# Altium project RK3328.PrjPcb (part 2 of 3)

## Sheet CPU_USB2_USB3_PHY.SchDoc
size A3; SheetNumber: 9; SheetTotal: 21
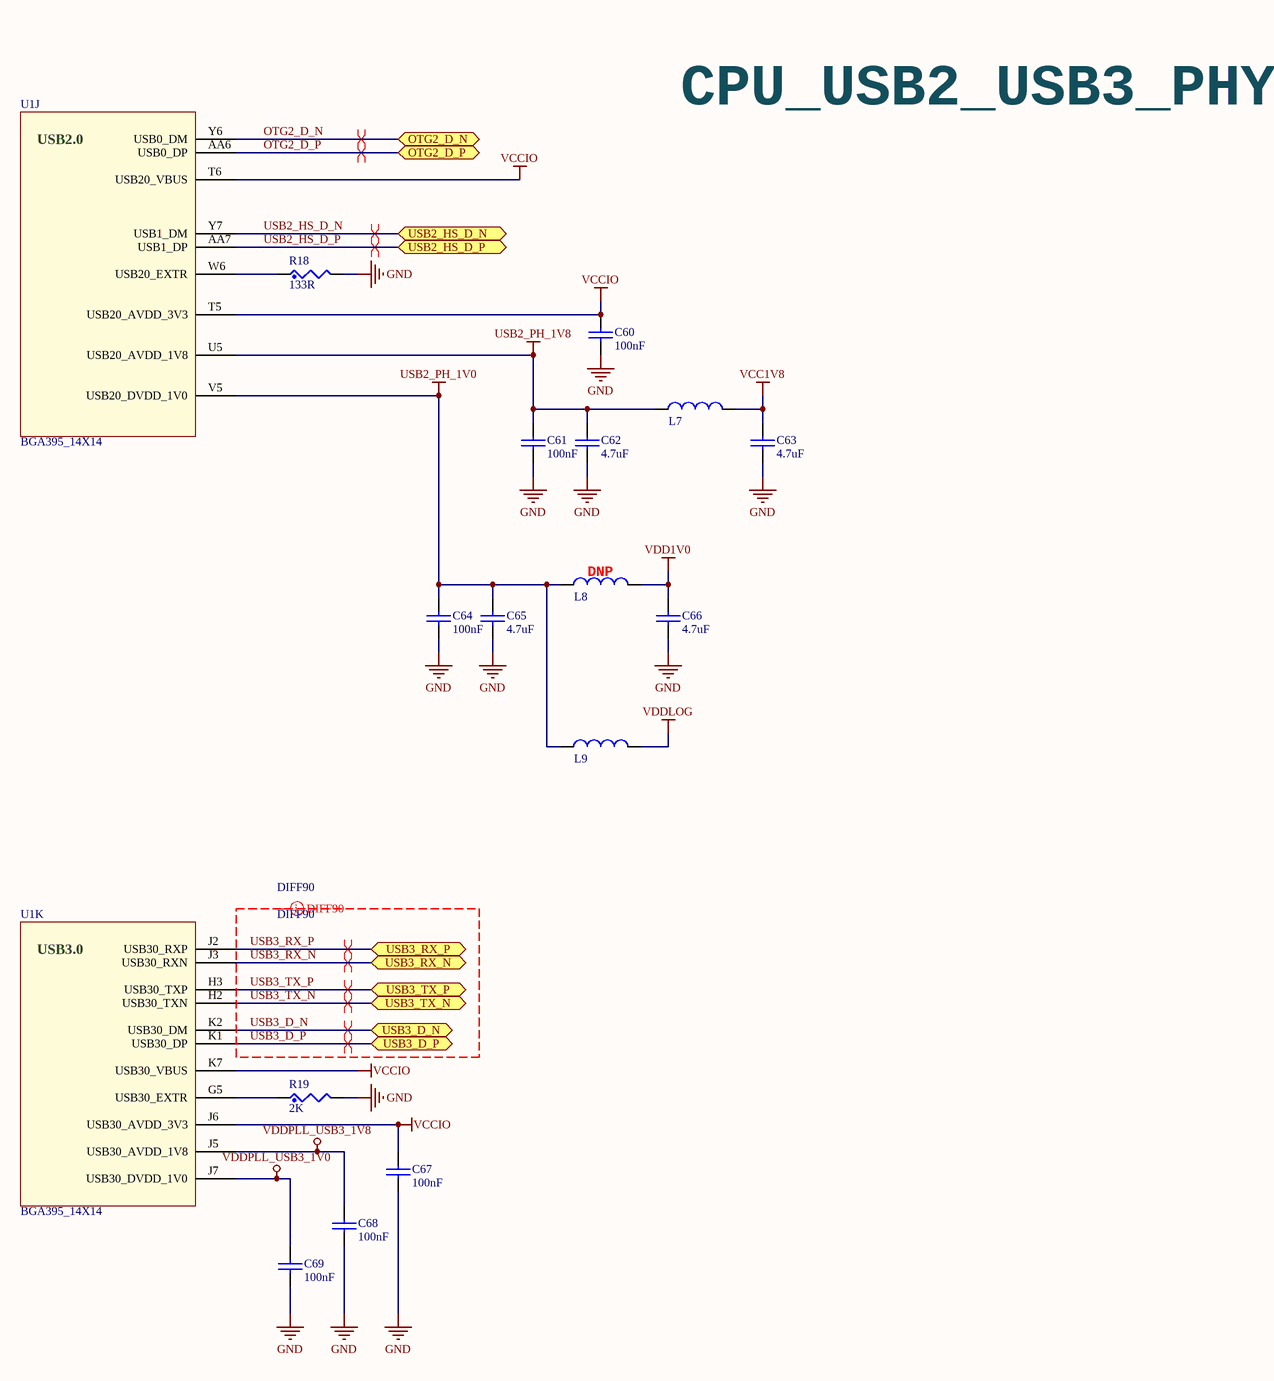
[diagram p9: CPU_USB2_USB3_PHY.SchDoc]

### Parts
C60  100nF  [0402_CC - C]
C61  100nF  [0402_CC - C]
C62  4.7uF  [0402_CC - C]
C63  4.7uF  [0402_CC - C]
C64  100nF  [0402_CC - C]
C65  4.7uF  [0402_CC - C]
C66  4.7uF  [0402_CC - C]
C67  100nF  [0402_CC - C]
C68  100nF  [0402_CC - C]
C69  100nF  [0402_CC - C]
L7  INDCHIP  [0603_C_Inductor]  (value not drawn)
L8  INDCHIP  [0603_C_Inductor]  (value not drawn)
L9  INDCHIP  [0603_C_Inductor]  (value not drawn)
R18  133R  [0402_CR]
R19  2K  [0402_CR]
U1  BGA395_14X14  [BGA395C65P21X21_1750X1750X117]  (parts J,K of 17)

### Ports
OTG2_D_N (bidir), OTG2_D_P (bidir), USB2_HS_D_N (bidir), USB2_HS_D_P (bidir), USB3_D_N (bidir), USB3_D_P (bidir), USB3_RX_N (bidir), USB3_RX_P (bidir), USB3_TX_N (bidir), USB3_TX_P (bidir)

### Nets
GND: C60.2 C61.2 C62.2 C63.2 C64.2 C65.2 C66.2 C67.2 C68.2 C69.2 R18.2 R19.2
USB2_PH_1V0: C64.1 C65.1 L8.1 L9.1 U1.V5(USB20_DVDD_1V0)
USB2_PH_1V8: C61.1 C62.1 L7.1 U1.U5(USB20_AVDD_1V8)
VCC1V8: C63.1 L7.2
VCCIO: C60.1 C67.1 U1.J6(USB30_AVDD_3V3) U1.K7(USB30_VBUS) U1.T5(USB20_AVDD_3V3) U1.T6(USB20_VBUS)
VDD1V0: C66.1 L8.2
VDDLOG: L9.2
VDDPLL_USB3_1V0: C69.1 U1.J7(USB30_DVDD_1V0)
VDDPLL_USB3_1V8: C68.1 U1.J5(USB30_AVDD_1V8)
OTG2_D_N: U1.Y6(USB0_DM) ; port OTG2_D_N
OTG2_D_P: U1.AA6(USB0_DP) ; port OTG2_D_P
USB2_HS_D_N: U1.Y7(USB1_DM) ; port USB2_HS_D_N
USB2_HS_D_P: U1.AA7(USB1_DP) ; port USB2_HS_D_P
USB3_D_N: U1.K2(USB30_DM) ; port USB3_D_N
USB3_D_P: U1.K1(USB30_DP) ; port USB3_D_P
USB3_RX_N: U1.J3(USB30_RXN) ; port USB3_RX_N
USB3_RX_P: U1.J2(USB30_RXP) ; port USB3_RX_P
USB3_TX_N: U1.H2(USB30_TXN) ; port USB3_TX_N
USB3_TX_P: U1.H3(USB30_TXP) ; port USB3_TX_P
NetR18_1: R18.1 U1.W6(USB20_EXTR)
NetR19_1: R19.1 U1.G5(USB30_EXTR)

### Layout directives
differential pair: OTG2_D_N, OTG2_D_P, USB2_HS_D_N, USB2_HS_D_P, USB3_D_N, USB3_D_P, USB3_RX_N, USB3_RX_P, USB3_TX_N, USB3_TX_P
differential pair; differential pair class DIFF90; net class DIFF90: USB3_D_N, USB3_D_P, USB3_RX_N, USB3_RX_P, USB3_TX_N, USB3_TX_P

### Notes on the sheet
- CPU_USB2_USB3_PHY
- (near L8) DNP
- (in symbol RK3328, part J) USB2.0
- (in symbol RK3328, part K) USB3.0

### Library data of the parts
C60-C69 = CAP_NP: CLASS: DISCRETE
L7-L9 = INDCHIP: Fixed Inductors  TDK, By AAR
R18 R19 = RES: CLASS: DISCRETE
U1 = RK3328: By AAR

## Sheet USB3.SchDoc
size A3; SheetNumber: 16; SheetTotal: 21
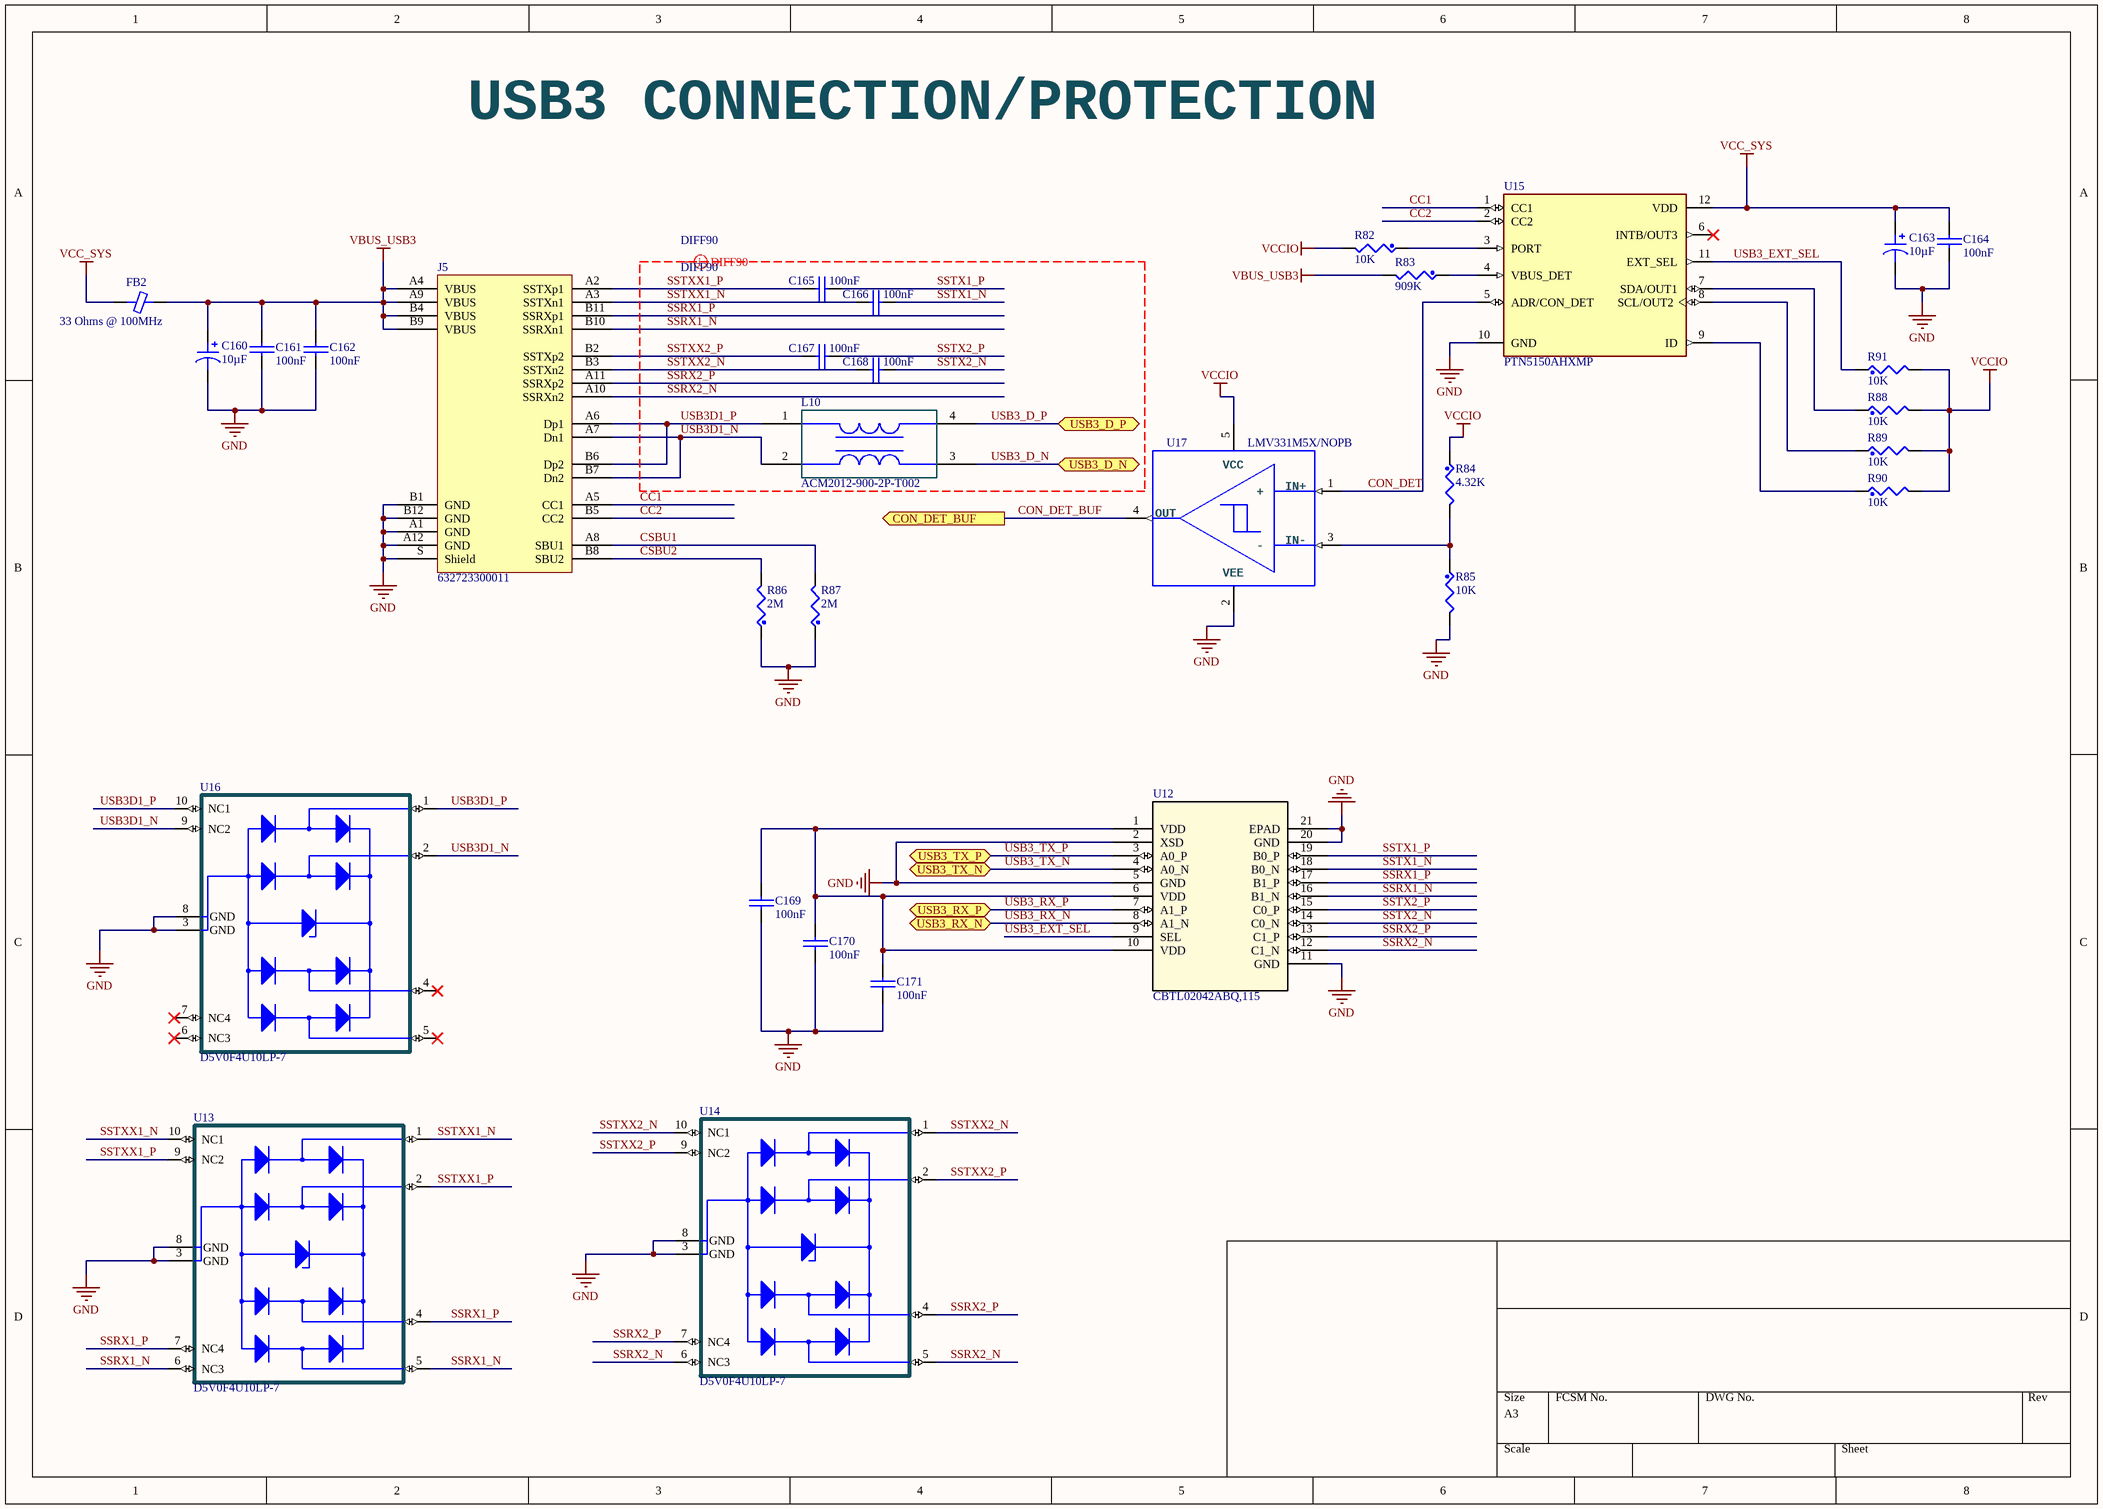
[diagram p10: USB3.SchDoc]

### Parts
C160  10µF  [CAP POL 1206_3216]
C161  100nF  [0402_CC - C]
C162  100nF  [0402_CC - C]
C163  10µF  [CAP POL 1206_3216]
C164  100nF  [0402_CC - C]
C165  100nF  [0402_CC - C]
C166  100nF  [0402_CC - C]
C167  100nF  [0402_CC - C]
C168  100nF  [0402_CC - C]
C169  100nF  [0402_CC - C]
C170  100nF  [0402_CC - C]
C171  100nF  [0402_CC - C]
FB2  33 Ohms @ 100MHz  [FER 0805_2012]
J5  632723300011  [WURTH 632723300011]
L10  ACM2012-900-2P-T002  [FP-ACM2012-MFG]
R82  10K  [0402_CR]
R83  909K  [0402_CR]
R84  4.32K  [0402_CR]
R85  10K  [0402_CR]
R86  2M  [0402_CR]
R87  2M  [0402_CR]
R88  10K  [0402_CR]
R89  10K  [0402_CR]
R90  10K  [0402_CR]
R91  10K  [0402_CR]
U12  CBTL02042ABQ,115  [DHVQFN20_SOT764-1_NXP-L]
U13  D5V0F4U10LP-7  [TI_TPD4E05U06DQAR]
U14  D5V0F4U10LP-7  [TI_TPD4E05U06DQAR]
U15  PTN5150AHXMP  [USBCONTROLLER_PTN5150AHXMP]
U16  D5V0F4U10LP-7  [TI_TPD4E05U06DQAR]
U17  LMV331M5X/NOPB  [MF05A]

### Ports
CON_DET_BUF (out), USB3_D_N (bidir), USB3_D_P (bidir), USB3_RX_N (bidir), USB3_RX_P (bidir), USB3_TX_N (bidir), USB3_TX_P (bidir)

### Nets
GND: C160.2 C161.2 C162.2 C163.2 C164.2 C169.2 C170.2 C171.2 J5.A1(GND) J5.A12(GND) J5.B1(GND) J5.B12(GND) J5.S(Shield) R85.2 R86.1 R87.1 U12.2(XSD) U12.5(GND) U12.11(GND) U12.20(GND) U12.21(EPAD) U13.3(GND) U13.8(GND) U14.3(GND) U14.8(GND) U15.10(GND) U16.3(GND) U16.8(GND) U17.2(V-)
VBUS_USB3: C160.1 C161.1 C162.1 FB2.2 J5.A4(VBUS) J5.A9(VBUS) J5.B4(VBUS) J5.B9(VBUS) R83.2
VCC_SYS: C163.1 C164.1 FB2.1 U15.12(VDD)
VCCIO: R82.2 R84.1 R88.2 R89.2 R90.2 R91.2 U17.5(V+)
CC1: J5.A5(CC1) U15.1(CC1)
CC2: J5.B5(CC2) U15.2(CC2)
CON_DET: U15.5(ADR/CON_DET) U17.1(IN+)
CON_DET_BUF: U17.4(OUT) ; port CON_DET_BUF
CSBU1: J5.A8(SBU1) R87.2
CSBU2: J5.B8(SBU2) R86.2
SSRX1_N: J5.B10(SSRXn1) U12.16(B1_N) U13.5(D2-) U13.6(NC3)
SSRX1_P: J5.B11(SSRXp1) U12.17(B1_P) U13.4(D2+) U13.7(NC4)
SSRX2_N: J5.A10(SSRXn2) U12.12(C1_N) U14.5(D2-) U14.6(NC3)
SSRX2_P: J5.A11(SSRXp2) U12.13(C1_P) U14.4(D2+) U14.7(NC4)
SSTX1_N: C166.2 U12.18(B0_N)
SSTX1_P: C165.2 U12.19(B0_P)
SSTX2_N: C168.2 U12.14(C0_N)
SSTX2_P: C167.2 U12.15(C0_P)
SSTXX1_N: C166.1 J5.A3(SSTXn1) U13.1(D1+) U13.10(NC1)
SSTXX1_P: C165.1 J5.A2(SSTXp1) U13.2(D1-) U13.9(NC2)
SSTXX2_N: C168.1 J5.B3(SSTXn2) U14.1(D1+) U14.10(NC1)
SSTXX2_P: C167.1 J5.B2(SSTXp2) U14.2(D1-) U14.9(NC2)
USB3_D_N: L10.3 ; port USB3_D_N
USB3_D_P: L10.4 ; port USB3_D_P
USB3_EXT_SEL: R91.1 U12.9(SEL) U15.11(EXT_SEL)
USB3_RX_N: U12.8(A1_N) ; port USB3_RX_N
USB3_RX_P: U12.7(A1_P) ; port USB3_RX_P
USB3_TX_N: U12.4(A0_N) ; port USB3_TX_N
USB3_TX_P: U12.3(A0_P) ; port USB3_TX_P
USB3D1_N: J5.A7(Dn1) J5.B7(Dn2) L10.2 U16.2(D1-) U16.9(NC2)
USB3D1_P: J5.A6(Dp1) J5.B6(Dp2) L10.1 U16.1(D1+) U16.10(NC1)
NetC169_1: C169.1 C170.1 C171.1 U12.1(VDD) U12.6(VDD) U12.10(VDD)
NetR82_1: R82.1 U15.3(PORT)
NetR83_1: R83.1 U15.4(VBUS_DET)
NetR84_2: R84.2 R85.1 U17.3(IN-)
NetR88_1: R88.1 U15.7(SDA/OUT1)
NetR89_1: R89.1 U15.8(SCL/OUT2)
NetR90_1: R90.1 U15.9(ID)

Not connected (* = marked no-connect by the designer): U15 6(INTB/OUT3)*; U16 4(D2+)* 5(D2-)* 6(NC3)* 7(NC4)*

### Layout directives
differential pair; differential pair class DIFF90; net class DIFF90: SSRX1_N, SSRX1_P, SSRX2_N, SSRX2_P, SSTX1_N, SSTX1_P, SSTX2_N, SSTX2_P, SSTXX1_N, SSTXX1_P, SSTXX2_N, SSTXX2_P, USB3_D_N, USB3_D_P, USB3D1_N, USB3D1_P

### Notes on the sheet
- USB3 CONNECTION/PROTECTION
- (in symbol LMV331M5X/NOPB) VCC; +; -; VEE

### Library data of the parts
C160 C163 = ATCC-211A-010-106M-T: CAP TANT 10UF 20% 10V 1206; manufacturer: Abracon LLC; Manufacturer Size Code: A; ESR (Equivalent Series Resistance): 4Ohm; Type: Molded; Part Number: ATCC-211A-010-106M-T; Value: 10µF; Capacitance: 10µF; componentlink1description: Datasheet; componentlink1url: https://abracon.com/Magnetics/inductors/ATCC-211.pdf; componentlink2description: DigiKey Link; componentlink2url: http://digikey.com/product-detail/en/abracon-llc/ATCC-211A-010-106M-T/ATCC-211A-010-106M-TCT-ND/4843468; Device Package: 1206 (3216 Metric); Features: General Purpose; Height - Seated (Max): 0.071" (1.80mm); lastupdated: 9/2/2020 1:15:55 AM; Lifecycle Status: Active; Minimum Order: 1; Mounting Type: Surface Mount; Operating Temperature: -55°C ~ 125°C; Package / Case: 1206 (3216 Metric); packaging: TapeAndReel; partid: 1668; Part Status: Active; price: 0.46; series: ATCC-211; Size / Dimension: 0.126" L x 0.063" W (3.20mm x 1.60mm); Supplier 1: DigiKey; Supplier Part Number 1: ATCC-211A-010-106M-TCT-ND; Tolerance: ±20%; Voltage - Rated: 10V
C161 C162 C164-C171 = CAP_NP: CLASS: DISCRETE
FB2 = Z0805C330ASMST: FERRITE BEAD 33 OHM 0805 1LN; Manufacturer: KEMET; Current Rating (Max): 1.2A; DC Resistance (DCR) (Max): 50mOhm; Filter Type: Signal Line; Number of Lines: 1; Part Number: Z0805C330ASMST; ComponentLink1Description: Datasheet; ComponentLink1URL: https://content.kemet.com/datasheets/F3115.pdf; ComponentLink2Description: DigiKey Link; ComponentLink2URL: http://digikey.com/product-detail/en/kemet/Z0805C330ASMST/399-9619-1-ND/3674058; Device Package: 0805 (2012 Metric); Height (Max): 0.041" (1.05mm); Impedance @ Frequency: 33 Ohms @ 100MHz; LastUpdated: 3/24/2022 2:23:39 PM; Lifecycle Status: Active; Minimum Order: 1; Mounting Type: Surface Mount; Operating Temperature: -55°C ~ 125°C; Package / Case: 0805 (2012 Metric); Packaging: TapeAndReel; PartId: 1206; Part Status: Active; Price: 0.04; Series: Z-SMS; Size / Dimension: 0.079" L x 0.049" W (2.00mm x 1.25mm); Supplier 1: DigiKey; Supplier Part Number 1: 399-9619-1-ND; Value: 33 Ohms @ 100MHz
J5 = 632723300011: CONN RCP USB3.1 TYPEC 24P SMD RA; Manufacturer: Würth Elektronik; Connector Type: USB - C (Type - C); Current Rating (Amps): 5A; Gender: Receptacle; Mating Cycles: 10000; Number of Contacts: 24; Number of Ports: 1; Shielding: Unshielded; Specifications: USB 3.1 (USB 3.1 Gen 2, Superspeed+); Voltage - Rated: 20VDC; Part Number: 632723300011; ComponentLink1Description: Datasheet; ComponentLink1URL: https://katalog.we-online.de/em/datasheet/632723x00011.pdf; ComponentLink2Description: DigiKey Link; ComponentLink2URL: http://digikey.com/product-detail/en/w-rth-elektronik/632723300011/732-9618-1-ND/5806673; LastUpdated: 5/24/2020 10:36:40 PM; Lifecycle Status: Active; Minimum Order: 1; Mounting Feature: Horizontal; Mounting Type: Surface Mount, Right Angle; Through Hole; Operating Temperature: -40°C ~ 105°C; Packaging: TapeAndReel; Part Status: Active; Price: 2.95; Series: WR-COM; Supplier 1: DigiKey; Supplier Part Number 1: 732-9618-1-ND; Termination: Solder
L10 = ACM2012-900-2P-T002: CMC 400MA 2LN 90 OHM SMD; Mfr_Name: TDK; Type: DEV; Copyright: Copyright (C) 2022 Ultra Librarian. All rights reserved.; Manufacturer_Part_Number: ACM2012-900-2P-T002; Digi-Key_Part_Number_1: 445-2207-2-ND; Digi-Key_Part_Number_2: 445-2207-1-ND; Digi-Key_Part_Number_3: 445-2207-6-ND; Digi-Key_Part_Number_4: 445-2207-2-NDL; RefDes: RefDes
R82-R91 = RES: CLASS: DISCRETE
U12 = CBTL02042ABQ,115: IC MUX/DEMUX 2:1 PCI 20DHVQFN; Mfr_Name: NXP; Copyright: Copyright (C) 2022 Ultra Librarian. All rights reserved.; Manufacturer_Part_Number: CBTL02042ABQ,115; Digi-Key_Part_Number_1: 568-6676-2-ND; Digi-Key_Part_Number_2: 568-6676-1-ND; Digi-Key_Part_Number_3: 568-6676-6-ND; RefDes: RefDes; Type: DEV
U13 U14 U16 = D5V0F4U10LP-7: TVS DIODE 5.5VWM 12VC U-DFN2510; Mfr: Diodes Incorporated; Price: None; Availability: Available; Value: *; Package: UFDFN-10 Texas Instruments; Mfr_Part_No: D5V0F4U10LP-7; Creator: AAR
U15 = PTN5150AHXMP: USB Controller USB Interface 12-X2QFN (1.6x1.6); Mfr: NXP USA; Value: *; Check_prices: https://www.snapeda.com/parts/PTN5150AHXMP/NXP%20USA%20Inc./view-part/925094/?ref=eda; Mfr_Part_Number: PTN5150AHXMP; Price: None; Package: XFQFN-12 NXP Semiconductors; Availability: Good
U17 = LMV331M5X/NOPB: IC COMPARATOR TINY LV SOT23-5; Mfr_Name: Texas Instruments; Manufacturer: NationalSemiconductor; Characteristics: LMV331M5SingleGeneralPurposeLowVoltageSingleComparator; CompType: ComparatorIC; TaMin_C: -400; TaMax_C: 850; ComponentLink1DescBC: LMV331Datasheet; ComponentLink2DescA4: LMV331WebPage; ComponentLink3DescAC: MF05APackageWebPage; Copyright: Copyright (C) 2022 Ultra Librarian. All rights reserved.; Manufacturer_Part_Number: LMV331M5X/NOPB; Digi-Key_Part_Number_1: 2156-LMV331M5X/NOPB-ND; Digi-Key_Part_Number_2: 2156-LMV331M5X/NOPB-TI-ND; Digi-Key_Part_Number_3: LMV331M5X/NOPBCT-ND; Digi-Key_Part_Number_4: LMV331M5X/NOPBDKR-ND; Digi-Key_Part_Number_5: LMV331M5X/NOPBTR-ND; RefDes: RefDes; Type: DEV; SymbolVersion: 2008-07-09; PartNumber: LMV331M5; PackageDescription: 5LeadSOT-23; PackageReference: MF05A_L; RoHS: O; ComponentLink1URL: http//wwwnationalcom/ds/LM/LMV331pdf; ComponentLink2URL: http//wwwnationalcom/pf/LM/LMV331html; ComponentLink3URL: http//wwwnationalcom/packaging/folders/mf05ahtml; Version: B1608; LatestRevisionDate: 2009-03-16; LatestRevisionNote: MassUpdate; Publisher: NationalSemiconductor; Published: 2009-03-16

## Sheet USB2_host_otg.SchDoc
size A3; SheetNumber: 17; SheetTotal: 21
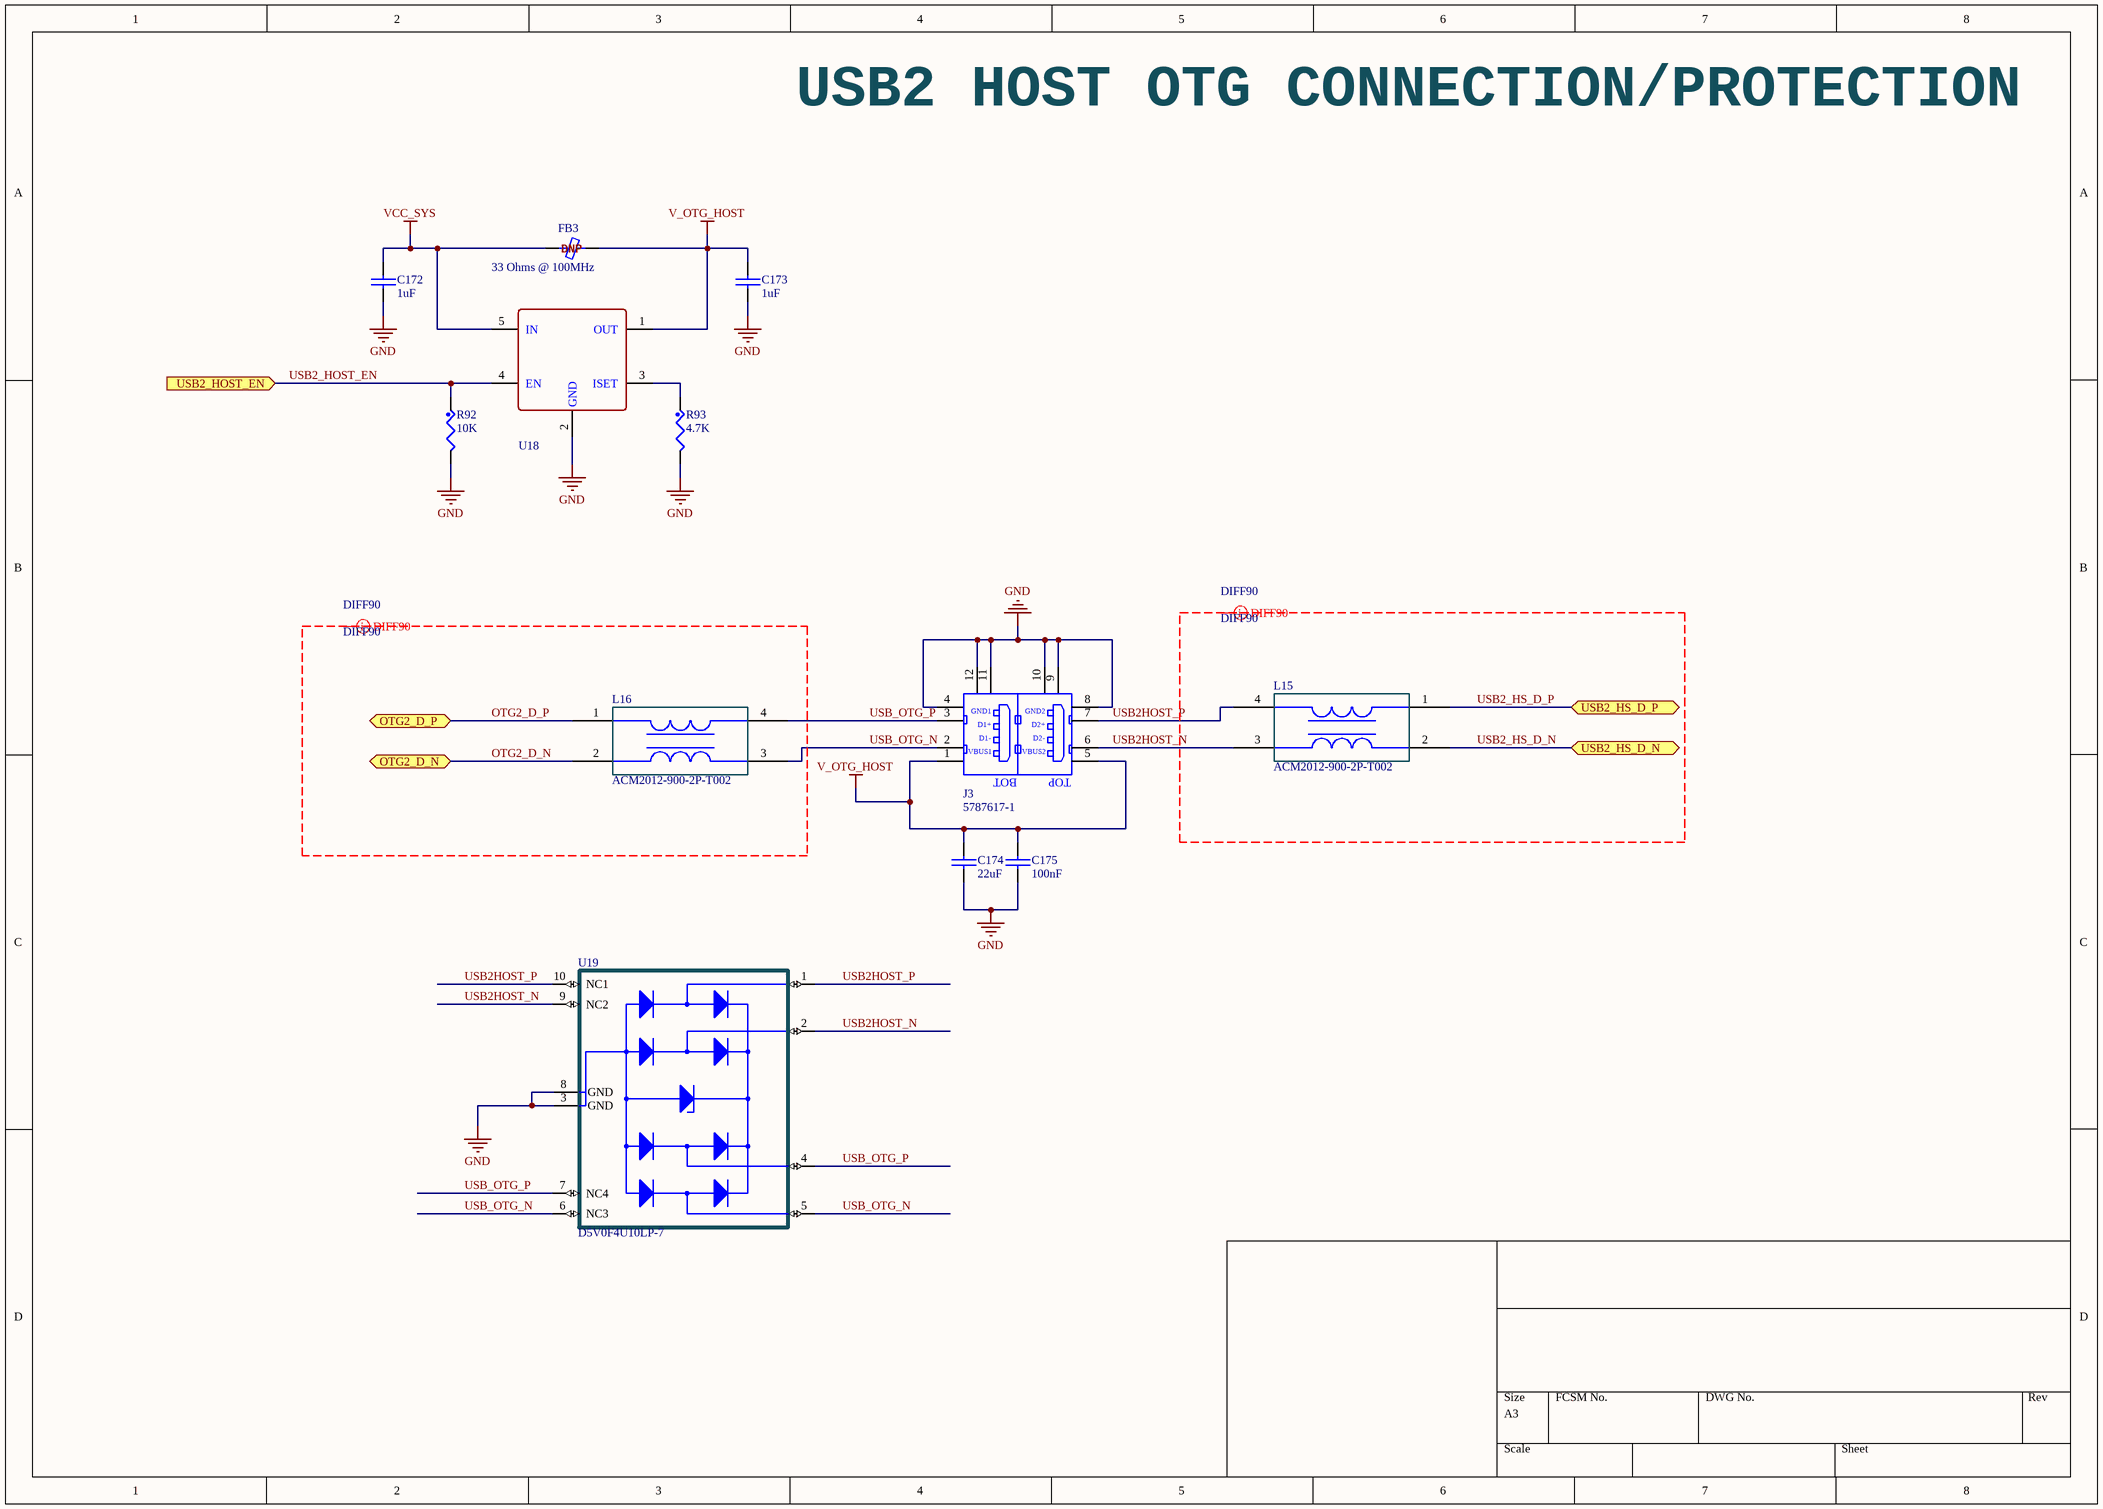
[diagram p11: USB2_host_otg.SchDoc]

### Parts
C172  1uF  [0603_CC]
C173  1uF  [0603_CC]
C174  22uF  [0603_CC]
C175  100nF  [0402_CC - C]
FB3  33 Ohms @ 100MHz  [FER 0805_2012]
J3  5787617-1  [USB-2A]
L15  ACM2012-900-2P-T002  [FP-ACM2012-MFG]
L16  ACM2012-900-2P-T002  [FP-ACM2012-MFG]
R92  10K  [0402_CR]
R93  4.7K  [0402_CR]
U18  Switch  [SOT23_5]  (value not drawn)
U19  D5V0F4U10LP-7  [TI_TPD4E05U06DQAR]

### Ports
OTG2_D_N (bidir), OTG2_D_P (bidir), USB2_HOST_EN (in), USB2_HS_D_N (bidir), USB2_HS_D_P (bidir)

### Nets
GND: C172.2 C173.2 C174.2 C175.2 J3.4(GND) J3.8(GND) J3.9(SHIELD) J3.10(SHIELD) J3.11(SHIELD) J3.12(SHIELD) R92.2 R93.2 U18.2(GND) U19.3(GND) U19.8(GND)
V_OTG_HOST: C173.1 C174.1 C175.1 FB3.2 J3.1(VBUS) J3.5(VBUS2) U18.1(OUT)
VCC_SYS: C172.1 FB3.1 U18.5(IN)
OTG2_D_N: L16.2 ; port OTG2_D_N
OTG2_D_P: L16.1 ; port OTG2_D_P
USB2_HOST_EN: R92.1 U18.4(EN) ; port USB2_HOST_EN
USB2_HS_D_N: L15.2 ; port USB2_HS_D_N
USB2_HS_D_P: L15.1 ; port USB2_HS_D_P
USB2HOST_N: J3.6(D2-) L15.3 U19.2(D1-) U19.9(NC2)
USB2HOST_P: J3.7(D2+) L15.4 U19.1(D1+) U19.10(NC1)
USB_OTG_N: J3.2(D-) L16.3 U19.5(D2-) U19.6(NC3)
USB_OTG_P: J3.3(D+) L16.4 U19.4(D2+) U19.7(NC4)
NetR93_1: R93.1 U18.3(ISET)

### Layout directives
differential pair; differential pair class DIFF90; net class DIFF90: OTG2_D_N, OTG2_D_P, USB2_HS_D_N, USB2_HS_D_P

### Notes on the sheet
- USB2 HOST OTG CONNECTION/PROTECTION
- (near FB3) DNP
- (in symbol 5787617-1_v1.1) GND1; GND2; D1+; D1-; VBUS1; BOT; TOP

### Library data of the parts
C172-C175 = CAP_NP: CLASS: DISCRETE
FB3 = Z0805C330ASMST: as FB2 on sheet USB3; Part Number: Z0805C330ASMST; ComponentLink1Description: Datasheet; ComponentLink1URL: https://content.kemet.com/datasheets/F3115.pdf; ComponentLink2Description: DigiKey Link; ComponentLink2URL: http://digikey.com/product-detail/en/kemet/Z0805C330ASMST/399-9619-1-ND/3674058; Device Package: 0805 (2012 Metric); Height (Max): 0.041" (1.05mm); Impedance @ Frequency: 33 Ohms @ 100MHz; LastUpdated: 3/24/2022 2:23:39 PM; Lifecycle Status: Active; Minimum Order: 1; Mounting Type: Surface Mount; Operating Temperature: -55°C ~ 125°C; Package / Case: 0805 (2012 Metric); Packaging: TapeAndReel; PartId: 1206; Part Status: Active; Price: 0.04; Series: Z-SMS; Size / Dimension: 0.079" L x 0.049" W (2.00mm x 1.25mm); Supplier 1: DigiKey; Supplier Part Number 1: 399-9619-1-ND; Value: 33 Ohms @ 100MHz
J3 = 5787617-1_v1.1: CONN RCPT R/A 4OVER4POS GOLD PCB; Manufacturer: TE Connectivity; Connector Type: USB - A, Stacked; Number of Contacts: 8; Gender: Receptacle; Specifications: USB 2.0; Category: Connectors, Interconnects; Family: USB, IEEE-1394 (Firewire), DVI, HDMI; Manufacturer Part Number: 5787617-1; Price 1k [$]: 1.68753; Supplier: Digikey; Supplier Part Number: A31728-ND; Value: 5787617-1; Supplier 1: Digi-Key; Supplier Part Number 1: A31728-ND; RoHS: RoHS Compliant; Stock 1: 5401; Pricing 1: 1=3.33, 10=3.197, 25=2.9308, 50=2.7978, 100=2.6645, 250=2.33144, 500=2.26484, 1000=1.93178, 2500=1.79855 (USD); Mounting Type: Through Hole, Right Angle, Horizontal; Features: Board Lock; Packaging: Tray; ComponentLink1URL: http://documents.tycoelectronics.com/commerce/DocumentDelivery/DDEController?Action=srchrtrv&DocNm=5787617&DocType=CD&DocLang=EN; ComponentLink1Description: http://documents.tycoelectronics.com/commerce/DocumentDelivery/DDEController?Action=srchrtrv&DocNm=5787617&DocType=CD&DocLang=EN
L15 L16 = ACM2012-900-2P-T002: as L10 on sheet USB3; Copyright: Copyright (C) 2022 Ultra Librarian. All rights reserved.; Manufacturer_Part_Number: ACM2012-900-2P-T002; Digi-Key_Part_Number_1: 445-2207-2-ND; Digi-Key_Part_Number_2: 445-2207-1-ND; Digi-Key_Part_Number_3: 445-2207-6-ND; Digi-Key_Part_Number_4: 445-2207-2-NDL; RefDes: RefDes
R92 R93 = RES: CLASS: DISCRETE
U18 = SY6280A: SY6280/  SY6280A  is  ultra-low  RDS(ON)  switch  with programmable current limit to protect the power source from  over  current  and  short  circuit  conditions, LIBs By AAR; Mfr_Part_No: SY6280AAC; Manufacturer: Silergy; Foot_Print: SOT-23; Supplier 1: Avnet; Supplier Part Number 1: SY6280AAAC; Package: SOT-23
U19 = D5V0F4U10LP-7: as U13 on sheet USB3; Price: None; Availability: Available; Value: *; Package: UFDFN-10 Texas Instruments; Mfr_Part_No: D5V0F4U10LP-7; Creator: AAR

## Sheet CPU_HDMI_PHY.SchDoc
size A3; SheetNumber: 10; SheetTotal: 21
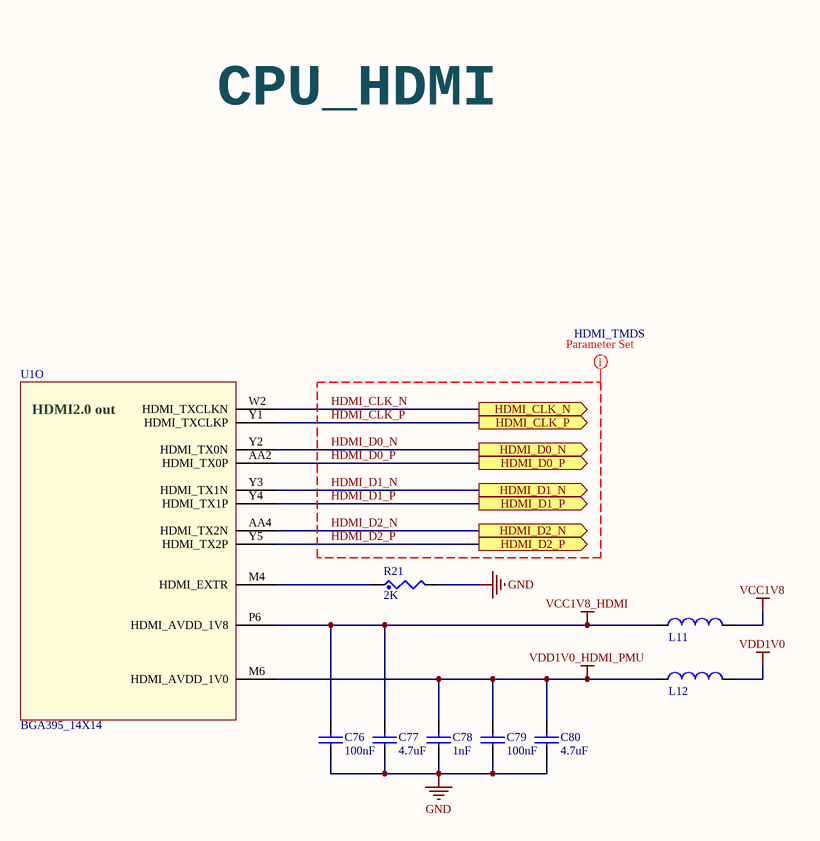
[diagram p12: CPU_HDMI_PHY.SchDoc]

### Parts
C76  100nF  [0402_CC - C]
C77  4.7uF  [0402_CC - C]
C78  1nF  [0402_CC - C]
C79  100nF  [0402_CC - C]
C80  4.7uF  [0402_CC - C]
L11  INDCHIP  [0603_C_Inductor]  (value not drawn)
L12  INDCHIP  [0603_C_Inductor]  (value not drawn)
R21  2K  [0402_CR]
U1  BGA395_14X14  [BGA395C65P21X21_1750X1750X117]  (part O of 17)

### Ports
HDMI_CLK_N (out), HDMI_CLK_P (out), HDMI_D0_N (out), HDMI_D0_P (out), HDMI_D1_N (out), HDMI_D1_P (out), HDMI_D2_N (out), HDMI_D2_P (out)

### Nets
GND: C76.2 C77.2 C78.2 C79.2 C80.2 R21.2
VCC1V8: L11.2
VCC1V8_HDMI: C76.1 C77.1 L11.1 U1.P6(HDMI_AVDD_1V8)
VDD1V0: L12.2
VDD1V0_HDMI_PMU: C78.1 C79.1 C80.1 L12.1 U1.M6(HDMI_AVDD_1V0)
HDMI_CLK_N: U1.W2(HDMI_TXCLKN) ; port HDMI_CLK_N
HDMI_CLK_P: U1.Y1(HDMI_TXCLKP) ; port HDMI_CLK_P
HDMI_D0_N: U1.Y2(HDMI_TX0N) ; port HDMI_D0_N
HDMI_D0_P: U1.AA2(HDMI_TX0P) ; port HDMI_D0_P
HDMI_D1_N: U1.Y3(HDMI_TX1N) ; port HDMI_D1_N
HDMI_D1_P: U1.Y4(HDMI_TX1P) ; port HDMI_D1_P
HDMI_D2_N: U1.AA4(HDMI_TX2N) ; port HDMI_D2_N
HDMI_D2_P: U1.Y5(HDMI_TX2P) ; port HDMI_D2_P
NetR21_1: R21.1 U1.M4(HDMI_EXTR)

### Layout directives
net class HDMI_TMDS: HDMI_CLK_N, HDMI_CLK_P, HDMI_D0_N, HDMI_D0_P, HDMI_D1_N, HDMI_D1_P, HDMI_D2_N, HDMI_D2_P

### Notes on the sheet
- CPU_HDMI
- (in symbol RK3328, part O) HDMI2.0 out

### Library data of the parts
C76-C80 = CAP_NP: CLASS: DISCRETE
L11 L12 = INDCHIP: Fixed Inductors  TDK, By AAR
R21 = RES: CLASS: DISCRETE
U1 = RK3328: By AAR

## Sheet HDMI.SchDoc
size A3; SheetNumber: 17; SheetTotal: 21
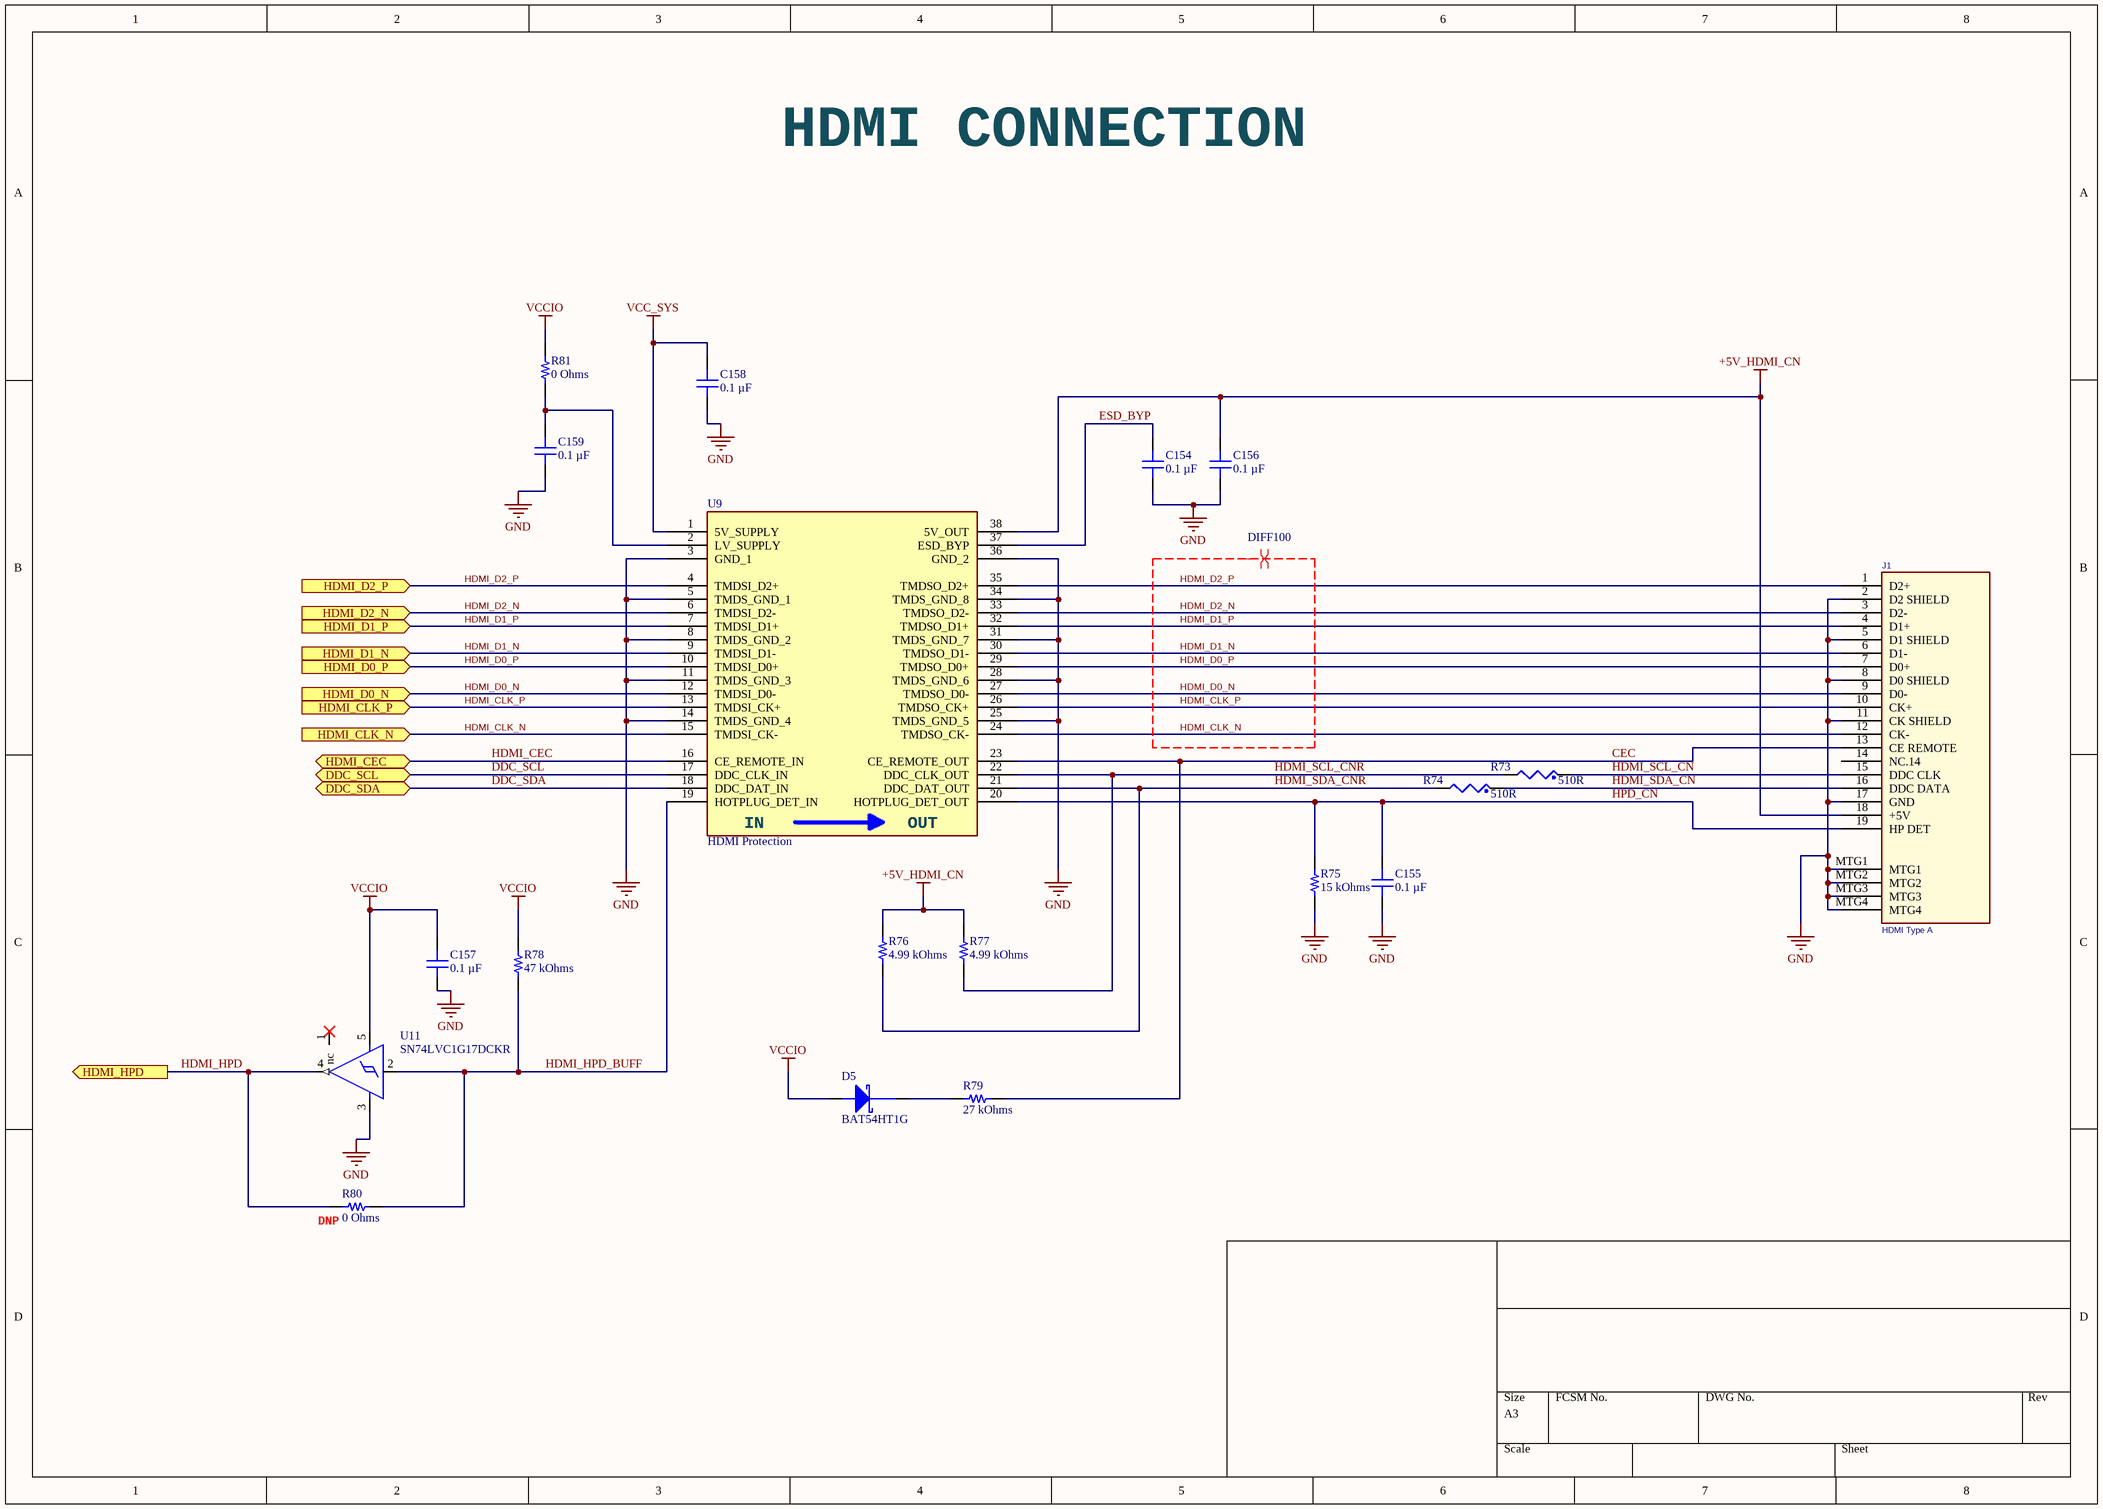
[diagram p13: HDMI.SchDoc]

### Parts
C154  0.1 µF  [CAP 0402_1005]
C155  0.1 µF  [CAP 0402_1005]
C156  0.1 µF  [CAP 0402_1005]
C157  0.1 µF  [CAP 0402_1005]
C158  0.1 µF  [CAP 0402_1005]
C159  0.1 µF  [CAP 0402_1005]
D5  BAT54HT1G  [SOD323]
J1  HDMI Type A  [HDMI Type-A]
R73  510R  [0402_CR]
R74  510R  [0402_CR]
R75  15 kOhms  [RES 0402_1005]
R76  4.99 kOhms  [RES 0402_1005]
R77  4.99 kOhms  [RES 0402_1005]
R78  47 kOhms  [RES 0402_1005]
R79  27 kOhms  [RES 0402_1005]
R80  0 Ohms  [RES 0402_1005]
R81  0 Ohms  [RES 0402_1005]
U9  HDMI Protection  [TSSOP50P640X120-38N]
U11  SN74LVC1G17DCKR  [SC70_5]

### Ports
DDC_SCL (bidir), DDC_SDA (bidir), HDMI_CEC (bidir), HDMI_CLK_N (in), HDMI_CLK_P (in), HDMI_D0_N (in), HDMI_D0_P (in), HDMI_D1_N (in), HDMI_D1_P (in), HDMI_D2_N (in), HDMI_D2_P (in), HDMI_HPD (out)

### Nets
+5V_HDMI_CN: C156.2 J1.18(+5V) R76.2 R77.2 U9.38(5V_OUT)
GND: C154.1 C155.1 C156.1 C157.1 C158.1 C159.1 J1.2(D2_SHIELD) J1.5(D1_SHIELD) J1.8(D0_SHIELD) J1.11(CK_SHIELD) J1.17(GND) J1.MTG1 J1.MTG2 J1.MTG3 J1.MTG4 R75.1 U9.3(GND_1) U9.5(TMDS_GND_1) U9.8(TMDS_GND_2) U9.11(TMDS_GND_3) U9.14(TMDS_GND_4) U9.25(TMDS_GND_5) U9.28(TMDS_GND_6) U9.31(TMDS_GND_7) U9.34(TMDS_GND_8) U9.36(GND_2) U11.3(GND)
VCC_SYS: C158.2 U9.1(5V_SUPPLY)
VCCIO: C157.2 D5.2(Anode) R78.2 R81.2 U11.5(NC1)
CEC: J1.13(CE_REMOTE) R79.2 U9.23(CE_REMOTE_OUT)
DDC_SCL: U9.17(DDC_CLK_IN) ; port DDC_SCL
DDC_SDA: U9.18(DDC_DAT_IN) ; port DDC_SDA
ESD_BYP: C154.2 U9.37(ESD_BYP)
HDMI_CEC: U9.16(CE_REMOTE_IN) ; port HDMI_CEC
HDMI_CLK_N: J1.12(CK-) U9.15(TMDSI_CK-) U9.24(TMDSO_CK-) ; port HDMI_CLK_N
HDMI_CLK_P: J1.10(CK+) U9.13(TMDSI_CK+) U9.26(TMDSO_CK+) ; port HDMI_CLK_P
HDMI_D0_N: J1.9(D0-) U9.12(TMDSI_D0-) U9.27(TMDSO_D0-) ; port HDMI_D0_N
HDMI_D0_P: J1.7(D0+) U9.10(TMDSI_D0+) U9.29(TMDSO_D0+) ; port HDMI_D0_P
HDMI_D1_N: J1.6(D1-) U9.9(TMDSI_D1-) U9.30(TMDSO_D1-) ; port HDMI_D1_N
HDMI_D1_P: J1.4(D1+) U9.7(TMDSI_D1+) U9.32(TMDSO_D1+) ; port HDMI_D1_P
HDMI_D2_N: J1.3(D2-) U9.6(TMDSI_D2-) U9.33(TMDSO_D2-) ; port HDMI_D2_N
HDMI_D2_P: J1.1(D2+) U9.4(TMDSI_D2+) U9.35(TMDSO_D2+) ; port HDMI_D2_P
HDMI_HPD: R80.1 U11.4(O) ; port HDMI_HPD
HDMI_HPD_BUFF: R78.1 R80.2 U9.19(HOTPLUG_DET_IN) U11.2(I)
HDMI_SCL_CN: J1.15(DDC_CLK) R73.1
HDMI_SCL_CNR: R73.2 R77.1 U9.22(DDC_CLK_OUT)
HDMI_SDA_CN: J1.16(DDC_DATA) R74.1
HDMI_SDA_CNR: R74.2 R76.1 U9.21(DDC_DAT_OUT)
HPD_CN: C155.2 J1.19(HP_DET) R75.2 U9.20(HOTPLUG_DET_OUT)
NetC159_2: C159.2 R81.1 U9.2(LV_SUPPLY)
NetD5_1: D5.1(Cathode) R79.1

Not connected (* = marked no-connect by the designer): J1 14(NC.14); U11 1(nc)*

### Layout directives
differential pair; differential pair class DIFF100: HDMI_CLK_N, HDMI_CLK_P, HDMI_D0_N, HDMI_D0_P, HDMI_D1_N, HDMI_D1_P, HDMI_D2_N, HDMI_D2_P

### Notes on the sheet
- HDMI CONNECTION
- (near R80) DNP
- (in symbol CM2020-00TR) IN; OUT

### Library data of the parts
C154-C159 = CC0402ZRY5V6BB104: CAP CER 0.1UF 10V Y5V 0402; manufacturer: Yageo; Temperature Coefficient: Y5V (F); Tolerance: -20%, +80%; Part Number: CC0402ZRY5V6BB104; Value: 0.1 µF; Applications: General Purpose; Capacitance: 0.1 µF; componentlink1description: Datasheet; componentlink1url: http://www.yageo.com/documents/recent/UPY-GPHC_Y5V_6.3V-to-50V_8.pdf; componentlink2description: DigiKey Link; componentlink2url: https://www.digikey.com/en/products/detail/yageo/CC0402ZRY5V6BB104/2833587; Device Package: 0402 (1005 Metric); lastupdated: 2/26/2022 9:02:21 AM; Lifecycle Status: Active; Minimum Order: 1; Mounting Type: Surface Mount, MLCC; Operating Temperature: -30°C ~ 85°C; Package / Case: 0402 (1005 Metric); packaging: CutTape; partid: 10069; Part Status: Active; price: 0.01; series: CC; Size / Dimension: 0.039" L x 0.020" W (1.00mm x 0.50mm); Supplier 1: DigiKey; Supplier Part Number 1: 311-1422-1-ND; Thickness (Max): 0.022" (0.55mm); Voltage - Rated: 10V
D5 = BAT54HT1G: DIODE SCHOTTKY 30V 0.2A SOD323; Manufacturer: Fairchild Semiconductor; Current - Average Rectified (Io): 200mA; Voltage - Forward (Vf) (Max) @ If: 800mV @ 100mA; Speed: Small Signal =< 200mA (Io), Any Speed; Reverse Recovery Time (trr): 5ns; Current - Reverse Leakage @ Vr: 2µA @ 25V; Capacitance @ Vr, F: 10pF @ 1V, 1MHz; Thermal Resistance: 600°C/W Ja; Supplier 1: Digi-Key; Manufacturer Part Number: BAT54HT1G; RoHS: RoHS Compliant; Category: Discrete Semiconductor Products; Stock 1: 11388; Pricing 1: 1=0.3, 10=0.276, 25=0.1984, 100=0.1543, 250=0.09696, 500=0.0826, 1000=0.05628 (USD); Packaging: Cut Tape (CT); Diode Type: Schottky; Voltage - DC Reverse (Vr) (Max): 30V; Mounting Type: Surface Mount; Package / Case: SC-76, SOD-323; Supplier Device Package: SOD-323; Operating Temperature - Junction: -55°C ~ 150°C; ComponentLink1URL: http://www.fairchildsemi.com/ds/BA/BAT54HT1G.pdf; ComponentLink1Description: http://www.fairchildsemi.com/ds/BA/BAT54HT1G.pdf; Supplier Part Number 1: BAT54HT1GCT-ND
J1 = HDMI Type A: CONN RCPT 19POS HDMI RT ANG SMD; Manufacturer: Molex Connector Corporation; Manufacturer Part Number: 47151-0001; .Checked PCB: MM; Number of Positions: 19; Pitch: 0.50mm (.020"); Value: 47151-0001; Gender: Receptacle; .Version: V1.1 - Changed holes to slots; .Checked SCH: MM; Category: Connectors, Interconnects; Connector Type: HDMI; Family: USB, IEEE-1394 (Firewire), DVI, HDMI; Operating Temperature: -20°C to +85°C; Price 1k [$]: 1.74610; Supplier: Digikey; Supplier Part Number: WM19086CT-ND; Supplier 1: Digi-Key; Supplier Part Number 1: WM19086CT-ND; RoHS: RoHS Compliant; Stock 1: 2756; Pricing 1: 1=3.1, 10=2.57, 50=2.1456, 100=1.9034 (USD); Number of Contacts: 19; Specifications: -; Mounting Type: Surface Mount, Right Angle, Horizontal; Features: Detent Lock; Packaging: Cut Tape (CT); Ingress Protection: -; ComponentLink1URL: http://www.molex.com/pdm_docs/sd/471510001_sd.pdf; ComponentLink1Description: http://www.molex.com/pdm_docs/sd/471510001_sd.pdf
R73 R74 = RES: CLASS: DISCRETE
R75 = RMCF0402FT15K0: RES 15K OHM 1% 1/16W 0402; Manufacturer: Stackpole Electronics Inc; Power (Watts): 0.063W, 1/16W; Temperature Coefficient: ±100ppm/°C; Part Number: RMCF0402FT15K0; Value: 15 kOhms; ComponentLink1Description: Datasheet; ComponentLink1URL: https://www.seielect.com/catalog/sei-rmcf_rmcp.pdf; ComponentLink2Description: DigiKey Link; ComponentLink2URL: https://www.digikey.com/en/products/detail/stackpole-electronics-inc/RMCF0402FT15K0/1761817; Composition: Thick Film; Device Package: 0402 (1005 Metric); Features: Automotive AEC-Q200; Height - Seated (Max): 0.016" (0.40mm); LastUpdated: 2/26/2022 8:42:09 AM; Lifecycle Status: Active; Minimum Order: 1; Number of Terminations: 2; Operating Temperature: -55°C ~ 155°C; Package / Case: 0402 (1005 Metric); Packaging: CutTape; PartId: 5006; Part Status: Active; Price: 0.01; Ratings: AEC-Q200; Resistance: 15 kOhms; Series: RMCF; Size / Dimension: 0.039" L x 0.020" W (1.00mm x 0.50mm); Supplier 1: DigiKey; Supplier Part Number 1: RMCF0402FT15K0CT-ND; Supplier Device Package: 0402; Tolerance: ±1%
R76 R77 = RN73C1E4K99BTD: RES SMD 4.99KOHM 0.1% 1/16W 0402; Manufacturer: TE Connectivity Passive Product; Power (Watts): 0.063W, 1/16W; Temperature Coefficient: ±10ppm/°C; Part Number: RN73C1E4K99BTD; Value: 4.99 kOhms; ComponentLink1Description: Datasheet; ComponentLink1URL: https://www.te.com/commerce/DocumentDelivery/DDEController?Action=srchrtrv&DocNm=1773270&DocType=DS&DocLang=English; ComponentLink2Description: DigiKey Link; ComponentLink2URL: http://digikey.com/product-detail/en/te-connectivity-passive-product/RN73C1E4K99BTD/A121705CT-ND/5248063; Composition: Thin Film; Device Package: 0402 (1005 Metric); Height - Seated (Max): 0.014" (0.35mm); LastUpdated: 2/26/2022 8:42:16 AM; Lifecycle Status: Active; Minimum Order: 1; Number of Terminations: 2; Operating Temperature: -55°C ~ 155°C; Package / Case: 0402 (1005 Metric); Packaging: TapeAndReel; PartId: 2964; Part Status: Active; Price: 0.26; Resistance: 4.99 kOhms; Series: RN73, Holsworthy; Size / Dimension: 0.039" L x 0.020" W (1.00mm x 0.50mm); Supplier 1: DigiKey; Supplier Part Number 1: A121705CT-ND; Supplier Device Package: 0402; Tolerance: ±0.1%
R78 = AC0402JR-0747KL: RES SMD 47K OHM 5% 1/16W 0402; Manufacturer: Yageo; Power (Watts): 0.063W, 1/16W; Temperature Coefficient: ±100ppm/°C; Part Number: AC0402JR-0747KL; Value: 47 kOhms; ComponentLink1Description: Datasheet; ComponentLink1URL: https://www.yageo.com/upload/media/product/productsearch/datasheet/rchip/PYu-AC_51_RoHS_L_7.pdf; ComponentLink2Description: DigiKey Link; ComponentLink2URL: https://www.digikey.com/en/products/detail/yageo/AC0402JR-0747KL/5895679; Composition: Thick Film; Device Package: 0402 (1005 Metric); Features: Automotive AEC-Q200, Moisture Resistant; Height - Seated (Max): 0.015" (0.37mm); LastUpdated: 2/26/2022 8:42:14 AM; Lifecycle Status: Active; Minimum Order: 1; Number of Terminations: 2; Operating Temperature: -55°C ~ 155°C; Package / Case: 0402 (1005 Metric); Packaging: CutTape; PartId: 3385; Part Status: Active; Price: 0.01; Ratings: AEC-Q200; Resistance: 47 kOhms; Series: AC; Size / Dimension: 0.039" L x 0.020" W (1.00mm x 0.50mm); Supplier 1: DigiKey; Supplier Part Number 1: YAG3547CT-ND; Supplier Device Package: 0402; Tolerance: ±5%
R79 = RC0402JR-0727KL: RES 27K OHM 5% 1/16W 0402; Manufacturer: Yageo; Power (Watts): 0.063W, 1/16W; Temperature Coefficient: ±100ppm/°C; Part Number: RC0402JR-0727KL; Value: 27 kOhms; ComponentLink1Description: Datasheet; ComponentLink1URL: https://www.yageo.com/upload/media/product/productsearch/datasheet/rchip/PYu-RC_Group_51_RoHS_L_10.pdf; ComponentLink2Description: DigiKey Link; ComponentLink2URL: https://www.digikey.com/en/products/detail/yageo/RC0402JR-0727KL/726451; Composition: Thick Film; Device Package: 0402 (1005 Metric); Features: Moisture Resistant; Height - Seated (Max): 0.016" (0.40mm); LastUpdated: 2/26/2022 8:42:09 AM; Lifecycle Status: Active; Minimum Order: 1; Number of Terminations: 2; Operating Temperature: -55°C ~ 155°C; Package / Case: 0402 (1005 Metric); Packaging: CutTape; PartId: 4832; Part Status: Active; Price: 0.01; Resistance: 27 kOhms; Series: RC_L; Size / Dimension: 0.039" L x 0.020" W (1.00mm x 0.50mm); Supplier 1: DigiKey; Supplier Part Number 1: 311-27KJRCT-ND; Supplier Device Package: 0402; Tolerance: ±5%
R80 R81 = CR0402AJ/-000GAS: RESA-AS 0402 0R JUMPER 63MW; Manufacturer: Bourns Inc.; Power (Watts): 0.063W, 1/16W; Part Number: CR0402AJ/-000GAS; Value: 0 Ohms; ComponentLink1Description: Datasheet; ComponentLink1URL: //media.digikey.com/pdf/Data%20Sheets/Bourns%20PDFs/CRyyyyA-AS_Model_DS.pdf; ComponentLink2Description: DigiKey Link; ComponentLink2URL: https://www.digikey.com/en/products/detail/bourns-inc/CR0402AJ-000GAS/10240110; Composition: Thick Film; Device Package: 0402 (1005 Metric); Features: Anti-Sulfur, Automotive AEC-Q200, Moisture Resistant; Height - Seated (Max): 0.015" (0.37mm); LastUpdated: 2/26/2022 8:42:02 AM; Lifecycle Status: Active; Minimum Order: 1; Number of Terminations: 2; Operating Temperature: -55°C ~ 155°C; Package / Case: 0402 (1005 Metric); Packaging: CutTape; PartId: 7106; Part Status: Active; Price: 0.01; Ratings: AEC-Q200; Resistance: 0 Ohms; Series: CR0402A-AS; Size / Dimension: 0.039" L x 0.020" W (1.00mm x 0.50mm); Supplier 1: DigiKey; Supplier Part Number 1: CR0402AJ/-000GASCT-ND; Supplier Device Package: 0402; Tolerance: Jumper
U9 = CM2020-00TR: HDMI Transmitter Port / Protection and Interface / Device 38-TSSOP; Mfr: ON Semiconductor; Value: *; Availability: Unavailable; Price: None; Mfr_Part_No: CM2020-00TR; Package: TSSOP-38 ON Semiconductor; Creator: Arman_Arvand
U11 = SN74LVC1G17DCKR: IC BUFFER SCHMIT TRIG SC705; Manufacturer: Texas Instruments; Logic Type: Schmitt Trigger - Buffer, Driver; Number of Elements: 1; Current - Output High, Low: 32mA, 32mA; Voltage - Supply: 1.65 V ~ 5.5 V; .Checked PCB: RF; Supplier 1: Digi-Key; Supplier Part Number 1: 296-11934-1-ND; Manufacturer Part Number: SN74LVC1G17DCKR; RoHS: RoHS Compliant; Category: Integrated Circuits (ICs); Stock 1: 50549; Pricing 1: 1=0.12, 10=0.097, 25=0.086, 100=0.0581, 250=0.05696, 500=0.0559, 750=0.05483 (USD); Number of Bits per Element: 1; Operating Temperature: -40°C ~ 85°C; Mounting Type: Surface Mount; Package / Case: 6-TSSOP (5 Lead), SC-88A, SOT-353; Supplier Device Package: SC-70-5; Packaging: Cut Tape (CT); ComponentLink1URL: http://www.ti.com/lit/ds/symlink/sn74lvc1g17.pdf; ComponentLink1Description: http://www.ti.com/lit/ds/symlink/sn74lvc1g17.pdf; .Checked SCH: RF

## Sheet CPU_ETH.SchDoc: CPU ETH
size A3; SheetNumber: 11; SheetTotal: 21
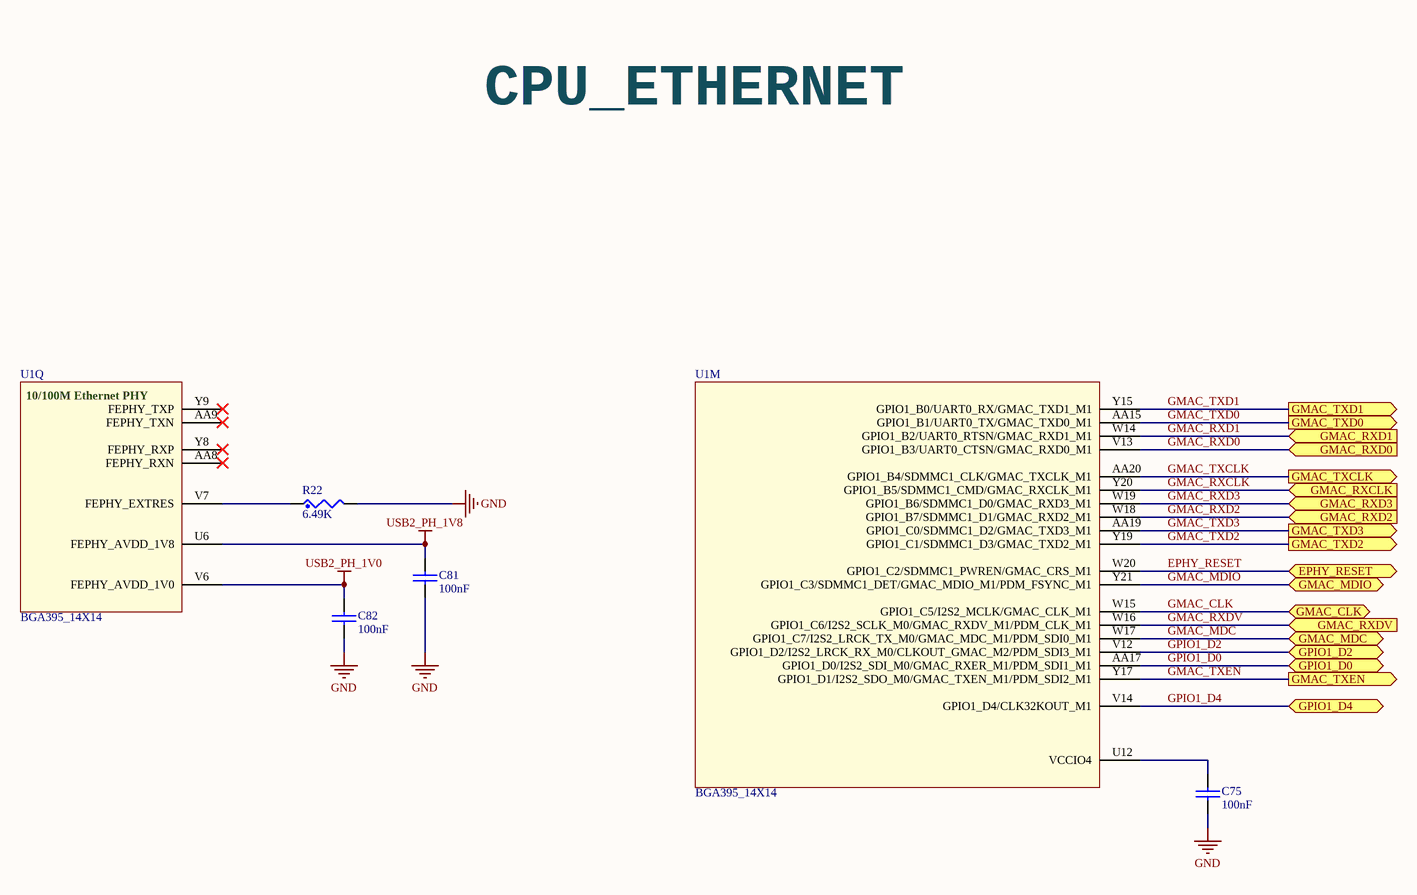
[diagram p14: CPU_ETH.SchDoc]

### Parts
C75  100nF  [0402_CC - C]
C81  100nF  [0402_CC - C]
C82  100nF  [0402_CC - C]
R22  6.49K  [0402_CR]
U1  BGA395_14X14  [BGA395C65P21X21_1750X1750X117]  (parts M,Q of 17)

### Ports
EPHY_RESET (bidir), GMAC_CLK (bidir), GMAC_MDC (bidir), GMAC_MDIO (bidir), GMAC_RXCLK (in), GMAC_RXD0 (in), GMAC_RXD1 (in), GMAC_RXD2 (in), GMAC_RXD3 (in), GMAC_RXDV (in), GMAC_TXCLK (out), GMAC_TXD0 (out), GMAC_TXD1 (out), GMAC_TXD2 (out), GMAC_TXD3 (out), GMAC_TXEN (out), GPIO1_D0 (bidir), GPIO1_D2 (bidir), GPIO1_D4 (bidir)

### Nets
GND: C75.1 C81.2 C82.2 R22.2
USB2_PH_1V0: C82.1 U1.V6(FEPHY_AVDD_1V0)
USB2_PH_1V8: C81.1 U1.U6(FEPHY_AVDD_1V8)
EPHY_RESET: U1.W20(GPIO1_C2/SDMMC1_PWREN/GMAC_CRS_M1) ; port EPHY_RESET
GMAC_CLK: U1.W15(GPIO1_C5/I2S2_MCLK/GMAC_CLK_M1) ; port GMAC_CLK
GMAC_MDC: U1.W17(GPIO1_C7/I2S2_LRCK_TX_M0/GMAC_MDC_M1/PDM_SDI0_M1) ; port GMAC_MDC
GMAC_MDIO: U1.Y21(GPIO1_C3/SDMMC1_DET/GMAC_MDIO_M1/PDM_FSYNC_M1) ; port GMAC_MDIO
GMAC_RXCLK: U1.Y20(GPIO1_B5/SDMMC1_CMD/GMAC_RXCLK_M1) ; port GMAC_RXCLK
GMAC_RXD0: U1.V13(GPIO1_B3/UART0_CTSN/GMAC_RXD0_M1) ; port GMAC_RXD0
GMAC_RXD1: U1.W14(GPIO1_B2/UART0_RTSN/GMAC_RXD1_M1) ; port GMAC_RXD1
GMAC_RXD2: U1.W18(GPIO1_B7/SDMMC1_D1/GMAC_RXD2_M1) ; port GMAC_RXD2
GMAC_RXD3: U1.W19(GPIO1_B6/SDMMC1_D0/GMAC_RXD3_M1) ; port GMAC_RXD3
GMAC_RXDV: U1.W16(GPIO1_C6/I2S2_SCLK_M0/GMAC_RXDV_M1/PDM_CLK_M1) ; port GMAC_RXDV
GMAC_TXCLK: U1.AA20(GPIO1_B4/SDMMC1_CLK/GMAC_TXCLK_M1) ; port GMAC_TXCLK
GMAC_TXD0: U1.AA15(GPIO1_B1/UART0_TX/GMAC_TXD0_M1) ; port GMAC_TXD0
GMAC_TXD1: U1.Y15(GPIO1_B0/UART0_RX/GMAC_TXD1_M1) ; port GMAC_TXD1
GMAC_TXD2: U1.Y19(GPIO1_C1/SDMMC1_D3/GMAC_TXD2_M1) ; port GMAC_TXD2
GMAC_TXD3: U1.AA19(GPIO1_C0/SDMMC1_D2/GMAC_TXD3_M1) ; port GMAC_TXD3
GMAC_TXEN: U1.Y17(GPIO1_D1/I2S2_SDO_M0/GMAC_TXEN_M1/PDM_SDI2_M1) ; port GMAC_TXEN
GPIO1_D0: U1.AA17(GPIO1_D0/I2S2_SDI_M0/GMAC_RXER_M1/PDM_SDI1_M1) ; port GPIO1_D0
GPIO1_D2: U1.V12(GPIO1_D2/I2S2_LRCK_RX_M0/CLKOUT_GMAC_M2/PDM_SDI3_M1) ; port GPIO1_D2
GPIO1_D4: U1.V14(GPIO1_D4/CLK32KOUT_M1) ; port GPIO1_D4
NetC75_2: C75.2 U1.U12(VCCIO4)
NetR22_1: R22.1 U1.V7(FEPHY_EXTRES)

Not connected (* = marked no-connect by the designer): U1 AA8(FEPHY_RXN)* AA9(FEPHY_TXN)* Y8(FEPHY_RXP)* Y9(FEPHY_TXP)*

### Notes on the sheet
- CPU_ETHERNET
- (in symbol RK3328, part Q) 10/100M Ethernet PHY

### Library data of the parts
C75 C81 C82 = CAP_NP: CLASS: DISCRETE
R22 = RES: CLASS: DISCRETE
U1 = RK3328: By AAR

## Sheet ETHERNET_PHY.SchDoc: ETHERNET PHY
size A3; Author: Arman Arvand; SheetNumber: 13; SheetTotal: 21
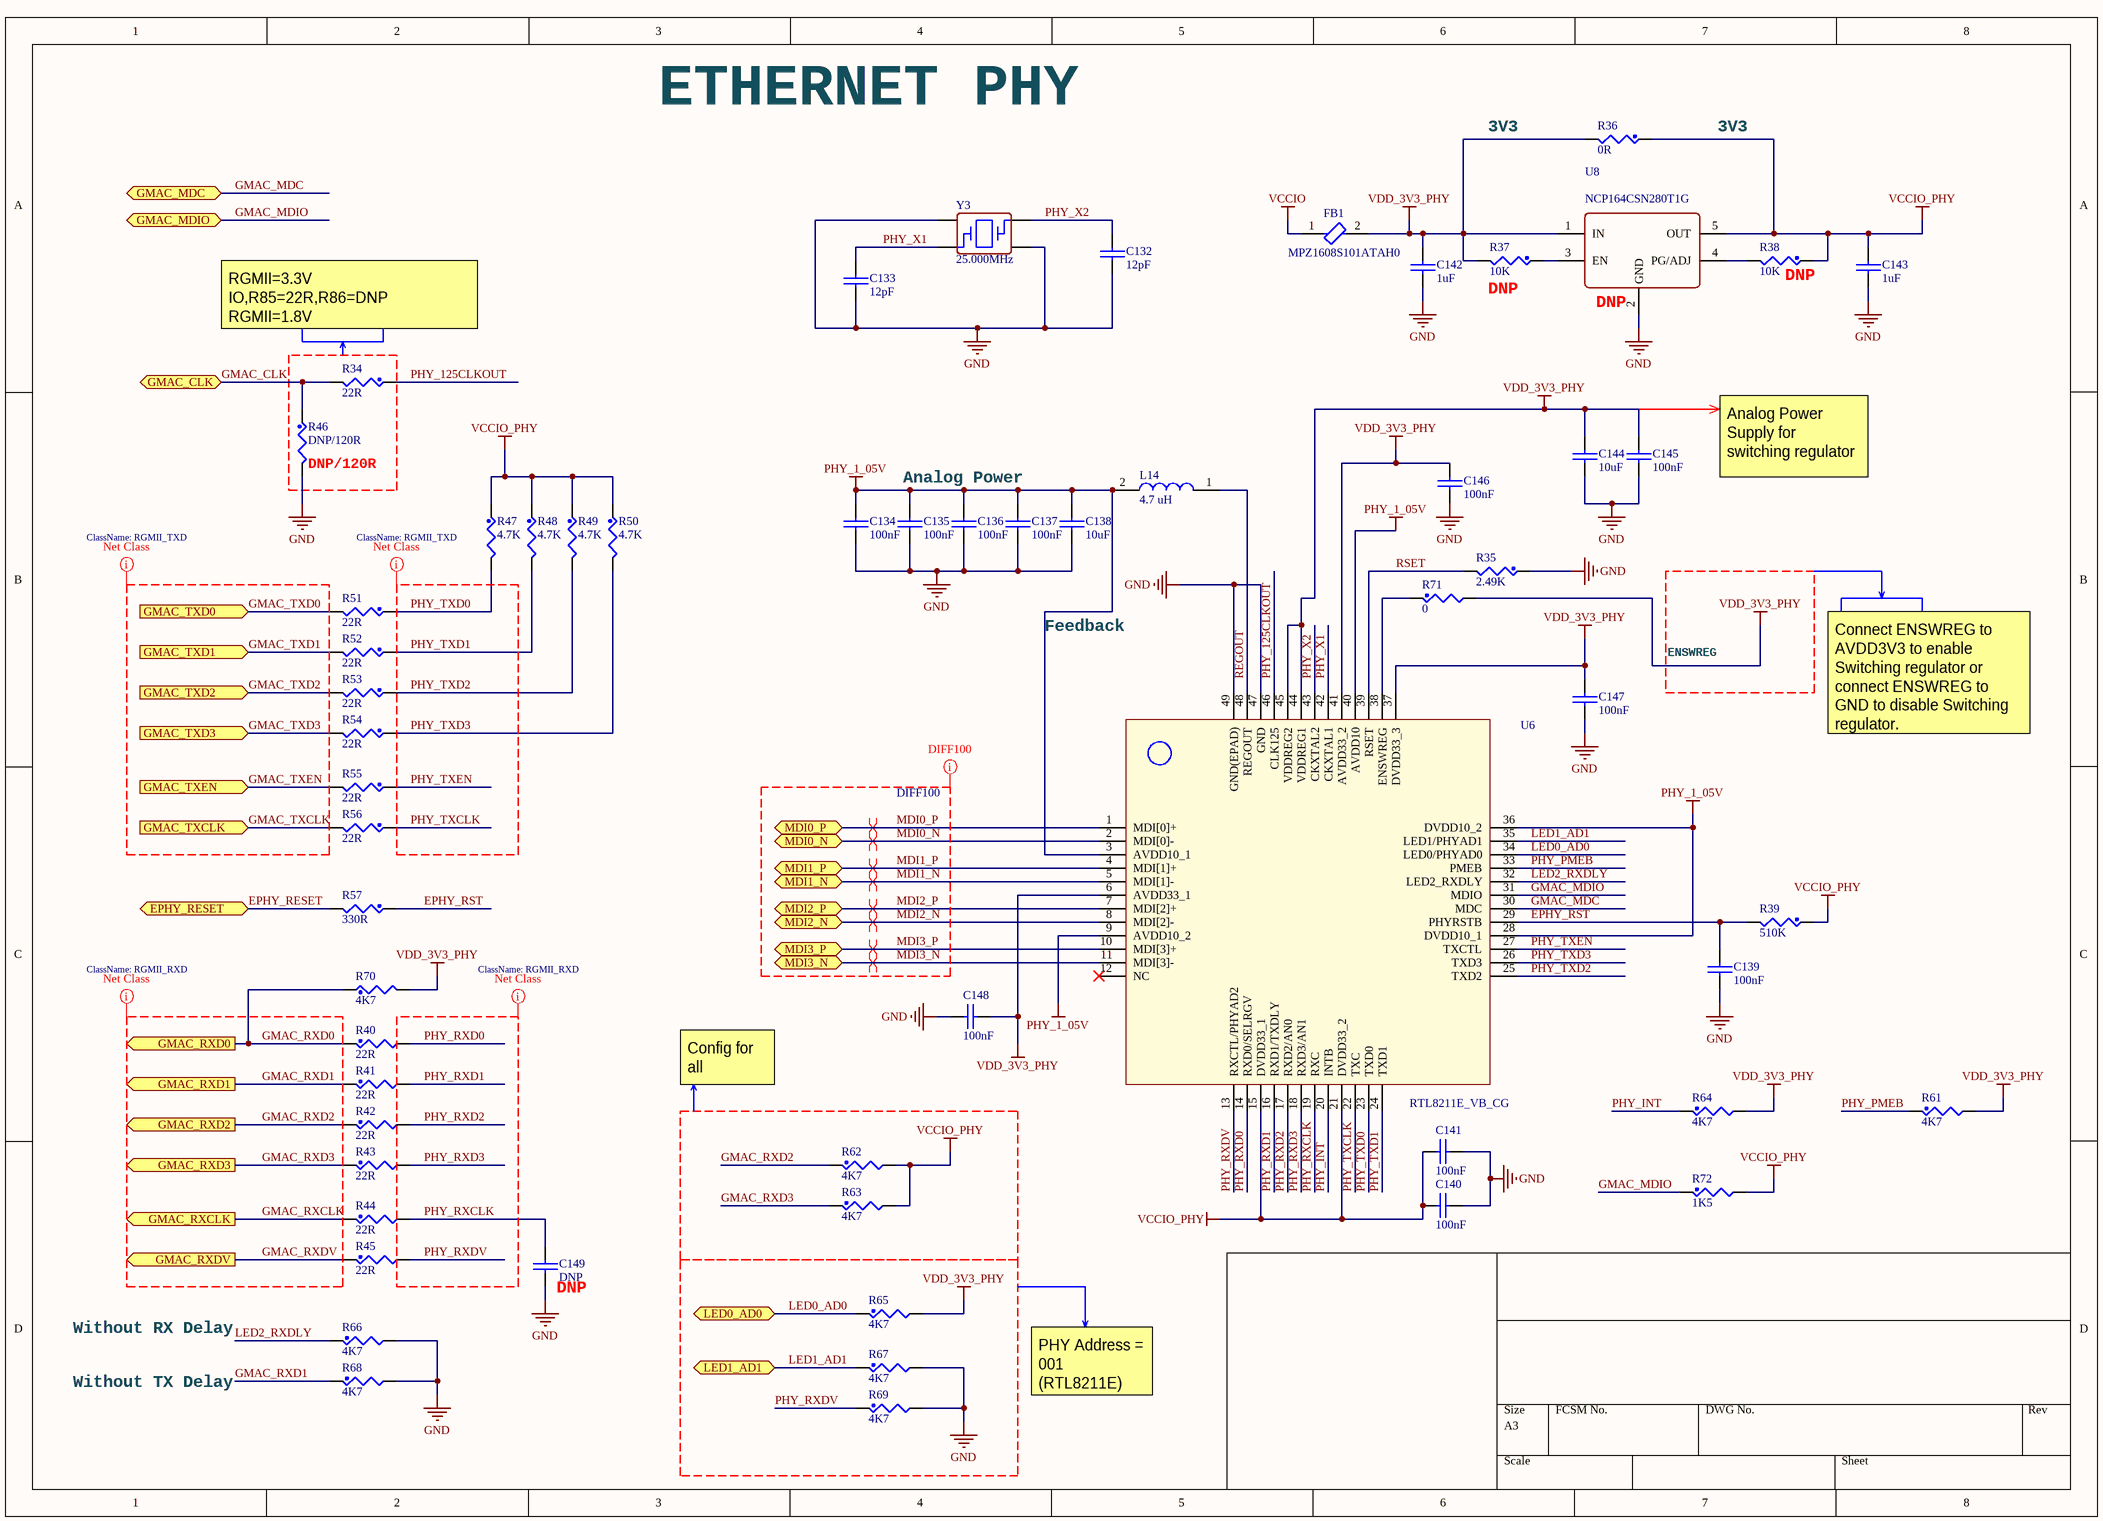
[diagram p15: ETHERNET_PHY.SchDoc]

### Parts
C132  12pF  [0402_CC - C]
C133  12pF  [0402_CC - C]
C134  100nF  [0402_CC - C]
C135  100nF  [0402_CC - C]
C136  100nF  [0402_CC - C]
C137  100nF  [0402_CC - C]
C138  10uF  [0603_CC]
C139  100nF  [0402_CC - C]
C140  100nF  [0402_CC - C]
C141  100nF  [0402_CC - C]
C142  1uF  [0402_CC - C]
C143  1uF  [0402_CC - C]
C144  10uF  [0603_CC]
C145  100nF  [0402_CC - C]
C146  100nF  [0402_CC - C]
C147  100nF  [0402_CC - C]
C148  100nF  [0402_CC - C]
C149  DNP  [0402_CC - C]
FB1  MPZ1608S101ATAH0  [FP-MPZ1608-0_6-IPC_A]
L14  4.7 uH  [1285ASH1R0MP2]
R34  22R  [0402_CR]
R35  2.49K  [0402_CR]
R36  0R  [0402_CR]
R37  10K  [0402_CR]
R38  10K  [0402_CR]
R39  510K  [0402_CR]
R40  22R  [0402_CR]
R41  22R  [0402_CR]
R42  22R  [0402_CR]
R43  22R  [0402_CR]
R44  22R  [0402_CR]
R45  22R  [0402_CR]
R46  DNP/120R  [0402_CR]
R47  4.7K  [0402_CR]
R48  4.7K  [0402_CR]
R49  4.7K  [0402_CR]
R50  4.7K  [0402_CR]
R51  22R  [0402_CR]
R52  22R  [0402_CR]
R53  22R  [0402_CR]
R54  22R  [0402_CR]
R55  22R  [0402_CR]
R56  22R  [0402_CR]
R57  330R  [0402_CR]
R61  4K7  [0402_CR]
R62  4K7  [0402_CR]
R63  4K7  [0402_CR]
R64  4K7  [0402_CR]
R65  4K7  [0402_CR]
R66  4K7  [0402_CR]
R67  4K7  [0402_CR]
R68  4K7  [0402_CR]
R69  4K7  [0402_CR]
R70  4K7  [0402_CR]
R71  0  [0402_CR]
R72  1K5  [0402_CR]
U6  RTL8211E_VB_CG  [QFN40P600X600X100-49N]
U8  NCP164CSN280T1G  [TSOP-5]
Y3  25.000MHz  [ABM8G]

### Blocks framed on the sheet
DNP/120R: R34 R46

### Ports
EPHY_RESET (bidir), GMAC_CLK (bidir), GMAC_MDC (bidir), GMAC_MDIO (bidir), GMAC_RXCLK (out), GMAC_RXD0 (out), GMAC_RXD1 (out), GMAC_RXD2 (out), GMAC_RXD3 (out), GMAC_RXDV (out), GMAC_TXCLK (in), GMAC_TXD0 (in), GMAC_TXD1 (in), GMAC_TXD2 (in), GMAC_TXD3 (in), GMAC_TXEN (in), LED0_AD0 (bidir), LED1_AD1 (bidir), MDI0_N (bidir), MDI0_P (bidir), MDI1_N (bidir), MDI1_P (bidir), MDI2_N (bidir), MDI2_P (bidir), MDI3_N (bidir), MDI3_P (bidir)

### Nets
GND: C132.2 C133.2 C134.2 C135.2 C136.2 C137.2 C138.2 C139.2 C140.2 C141.2 C142.2 C143.2 C144.2 C145.2 C146.1 C147.1 C148.1 C149.1 R35.1 R46.2 R66.2 R67.2 R68.2 R69.2 U6.47(GND) U6.49(GND(EPAD)) U8.2(GND) Y3.2 Y3.4
PHY_1_05V: C134.1 C135.1 C136.1 C137.1 C138.1 L14.2 U6.3(AVDD10_1) U6.9(AVDD10_2) U6.28(DVDD10_1) U6.36(DVDD10_2) U6.40(AVDD10)
VCCIO: FB1.1
VCCIO_PHY: C140.1 C141.1 C143.1 R36.1 R38.1 R39.1 R47.1 R48.1 R49.1 R50.1 R62.2 R63.2 R72.2 U6.15(DVDD33_1) U6.21(DVDD33_2) U8.5(OUT)
VDD_3V3_PHY: C142.1 C144.1 C145.1 C146.2 C147.2 C148.2 FB1.2 R36.2 R37.2 R61.2 R64.2 R65.2 R70.2 R71.2 U6.6(AVDD33_1) U6.37(DVDD33_3) U6.41(AVDD33_2) U6.44(VDDREG1) U6.45(VDDREG2) U8.1(IN)
EPHY_RESET: R57.2 ; port EPHY_RESET
EPHY_RST: C139.1 R39.2 R57.1 U6.29(PHYRSTB)
GMAC_CLK: R34.2 R46.1 ; port GMAC_CLK
GMAC_MDC: U6.30(MDC) ; port GMAC_MDC
GMAC_MDIO: R72.1 U6.31(MDIO) ; port GMAC_MDIO
GMAC_RXCLK: R44.1 ; port GMAC_RXCLK
GMAC_RXD0: R40.1 R70.1 ; port GMAC_RXD0
GMAC_RXD1: R41.1 R68.1 ; port GMAC_RXD1
GMAC_RXD2: R42.1 R62.1 ; port GMAC_RXD2
GMAC_RXD3: R43.1 R63.1 ; port GMAC_RXD3
GMAC_RXDV: R45.1 ; port GMAC_RXDV
GMAC_TXCLK: R56.2 ; port GMAC_TXCLK
GMAC_TXD0: R51.2 ; port GMAC_TXD0
GMAC_TXD1: R52.2 ; port GMAC_TXD1
GMAC_TXD2: R53.2 ; port GMAC_TXD2
GMAC_TXD3: R54.2 ; port GMAC_TXD3
GMAC_TXEN: R55.2 ; port GMAC_TXEN
LED0_AD0: R65.1 U6.34(LED0/PHYAD0) ; port LED0_AD0
LED1_AD1: R67.1 U6.35(LED1/PHYAD1) ; port LED1_AD1
LED2_RXDLY: R66.1 U6.32(LED2_RXDLY)
MDI0_N: U6.2(MDI[0]-) ; port MDI0_N
MDI0_P: U6.1(MDI[0]+) ; port MDI0_P
MDI1_N: U6.5(MDI[1]-) ; port MDI1_N
MDI1_P: U6.4(MDI[1]+) ; port MDI1_P
MDI2_N: U6.8(MDI[2]-) ; port MDI2_N
MDI2_P: U6.7(MDI[2]+) ; port MDI2_P
MDI3_N: U6.11(MDI[3]-) ; port MDI3_N
MDI3_P: U6.10(MDI[3]+) ; port MDI3_P
PHY_125CLKOUT: R34.1 U6.46(CLK125)
PHY_INT: R64.1 U6.20(INTB)
PHY_PMEB: R61.1 U6.33(PMEB)
PHY_RXCLK: C149.2 R44.2 U6.19(RXC)
PHY_RXD0: R40.2 U6.14(RXD0/SELRGV)
PHY_RXD1: R41.2 U6.16(RXD1/TXDLY)
PHY_RXD2: R42.2 U6.17(RXD2/AN0)
PHY_RXD3: R43.2 U6.18(RXD3/AN1)
PHY_RXDV: R45.2 R69.1 U6.13(RXCTL/PHYAD2)
PHY_TXCLK: R56.1 U6.22(TXC)
PHY_TXD0: R47.2 R51.1 U6.23(TXD0)
PHY_TXD1: R48.2 R52.1 U6.24(TXD1)
PHY_TXD2: R49.2 R53.1 U6.25(TXD2)
PHY_TXD3: R50.2 R54.1 U6.26(TXD3)
PHY_TXEN: R55.1 U6.27(TXCTL)
PHY_X1: C133.1 U6.42(CKXTAL1) Y3.1
PHY_X2: C132.1 U6.43(CKXTAL2) Y3.3
REGOUT: L14.1 U6.48(REGOUT)
RSET: R35.2 U6.39(RSET)
NetR37_1: R37.1 U8.3(EN)
NetR38_2: R38.2 U8.4(PG/ADJ)
NetR71_1: R71.1 U6.38(ENSWREG)

Not connected (* = marked no-connect by the designer): U6 12(NC)*

### Layout directives
differential pair: MDI0_N, MDI0_P, MDI1_N, MDI1_P, MDI2_N, MDI2_P, MDI3_N, MDI3_P
net class DIFF100: MDI0_N, MDI0_P, MDI1_N, MDI1_P, MDI2_N, MDI2_P, MDI3_N, MDI3_P
net class RGMII_TXD: GMAC_TXCLK, GMAC_TXD0, GMAC_TXD1, GMAC_TXD2, GMAC_TXD3, GMAC_TXEN, PHY_TXCLK, PHY_TXD0, PHY_TXD1, PHY_TXD2, PHY_TXD3, PHY_TXEN
net class RGMII_RXD: GMAC_RXCLK, GMAC_RXD0, GMAC_RXD1, GMAC_RXD2, GMAC_RXD3, GMAC_RXDV, PHY_RXCLK, PHY_RXD0, PHY_RXD1, PHY_RXD2, PHY_RXD3, PHY_RXDV

### Notes on the sheet
- ETHERNET PHY
- 3V3
- RGMII=3.3V IO,R85=22R,R86=DNP
  RGMII=1.8V IO,R85=100R,R86=120R
- (near R37) DNP
- (near U8) DNP
- (near R38) DNP
- Analog Power
- Analog Power Supply for switching regulator
- Feedback
- ENSWREG
- Connect ENSWREG to AVDD3V3 to enable Switching regulator or connect ENSWREG to GND to disable Switching regulator.
- Config for all capability
- Without RX Delay
- (near C149) DNP
- Without TX Delay
- PHY Address = 001 (RTL8211E)

### Library data of the parts
C132-C149 = CAP_NP: CLASS: DISCRETE
FB1 = MPZ1608S101ATAH0: Ferrite Beads 100ohms 3A 30mOhms 0603 Ferrite Chip / Creator ARMAN; Mfr: TDK; Tolerance: 25%; Impedance: 100R; DC Resistance (DCR): 30mR; Max DC Current: 3A; Packaging: Tape and Reel; Length: 0.063inch; Depth: 0.8mm; Current Rating: 3A; Mount: Surface Mount; Width: 0.031inch; Case Code (Imperial): 0603; Case Code (Metric): 1608; Height: 0.03inch; Core Material: Ferrite; REACH SVHC: No SVHC; Package Quantity: 4000; RoHS Compliant: Yes; Case/Package: 0603; Mfr_Part_No: MPZ1608S101ATAH0; Mouser No: 810-MPZ1608S101ATAH0; Supplier 1: Arrow Electronics; Supplier 2: Mouser; Supplier Part Number 1: MPZ1608S101ATAH0; Supplier Part Number 2: 810-MPZ1608S101ATAH0
L14 = DFE201610E_4R7M_P2_1: Fixed Inductors 08064.7 uH 20% 4.8A RDC=0.032ohms / Creator Arman; Mfr: Murata Electronics; Mfr_Part_No: DFE201610E-4R7M=P2; Datasheet Link: https://psearch.en.murata.com/inductor/product/DFE201610E-4R7M%23.html; Height: 1mm; Mouser N: 81-DFE201610E-4R7MP2; Mouser Price/Stock: https://www.mouser.co.uk/ProductDetail/Murata-Electronics/DFE201610E-4R7M%3dP2?qs=AQlKX63v8RuIglbQNBhlhg%3D%3D; Supplier 1: Digi-Key; Supplier Part Number 1: 490-18108-6-ND; Inductance: 4.7 uH
R34-R57 R61-R72 = RES: CLASS: DISCRETE
U6 = RTL8211E_VB_CG: Ethernet Transceivers 10/100/1000 Base-T PHY GMII, MII, RGMII 1.43V ~ 3.63V QFN-48_6x6x04P Ethernet ICs RoHS / LIBs : By AAR; Mfr_Part_No: RTL8211E-VB-CG; ComponentLink1Description: LCSC; ComponentLink1URL: https://lcsc.com/product-detail/_REALTEK_RTL8211E-VB-CG_RTL8211E-VB-CG_C90735.html?currency=SGD; foot print: QFN-48_6x6x04P; LCSC Part #: C90735; Package: QFN-48_6x6x04P
U8 = NCP164CSN280T1G: LDO Regulator, 300mA, / Low Dropout Voltage, Ultra / Low Noise, High PSRR with / Power Good; Mfr: ON Semiconductor; Output Voltage: 2.8V; Height: 1.1mm; Mfr_Part_No: NCP164CSN280T1G; Mouser No: 863-NCP164CSN280T1G; Output Current: 300mA; Supplier 1: DigiKey; Supplier 2: Mouser; Supplier 3: DigiKey; Supplier 4: Mouser; Supplier 5: Digi-Key; Supplier 6: Mouser; Supplier Part Number 1: 488-NCP164CSN180T1GTR-ND; Supplier Part Number 2: 863-NCP164CSN180T1G; Supplier Part Number 3: 488-NCP164CSN180T1GTR-ND; Supplier Part Number 4: 863-NCP164CSN180T1G; Supplier Part Number 5: 488-NCP164CSN280T1GCT-ND; Supplier Part Number 6: 863-NCP164CSN280T1G
Y3 = ABM8G-25.000MHZ-18-D2Y-T: CRYSTAL 25MHZ 18PF SMD / Created by Arman Arvand; Mfr: Abracon Corporation; Frequency Stability: ±30ppm; Frequency Tolerance: ±20ppm; ESR (Equivalent Series Resistance): 60 Ohm; Operating Mode: Fundamental; Mfr_Part_No: ABM8G-25.000MHZ-18-D2Y-T; RoHS: RoHS Compliant; Category: Crystals and Oscillators; Stock 1: 25549; Pricing 1: 1=1.06, 10=0.944, 50=0.8814, 100=0.78, 500=0.7371 (USD); Packaging: Cut Tape (CT); Type: MHz Crystal; Frequency: 25MHz; Load Capacitance: 18pF; Operating Temperature: -40°C ~ 85°C; Ratings: -; Mounting Type: Surface Mount; Package / Case: 4-SMD, No Lead (DFN, LCC); Size / Dimension: 0.126" L x 0.098" W (3.20mm x 2.50mm); Height: 0.039" (1.00mm); ComponentLink1URL: http://www.abracon.com/Resonators/ABM8G.pdf; ComponentLink1Description: http://www.abracon.com/Resonators/ABM8G.pdf; Supplier 1: Digi-Key; Supplier 2: Newark; Supplier Part Number 1: 535-10275-1-ND; Supplier Part Number 2: 29AC2068

## Sheet ETHERNET.SchDoc
size A3; SheetNumber: 14; SheetTotal: 21
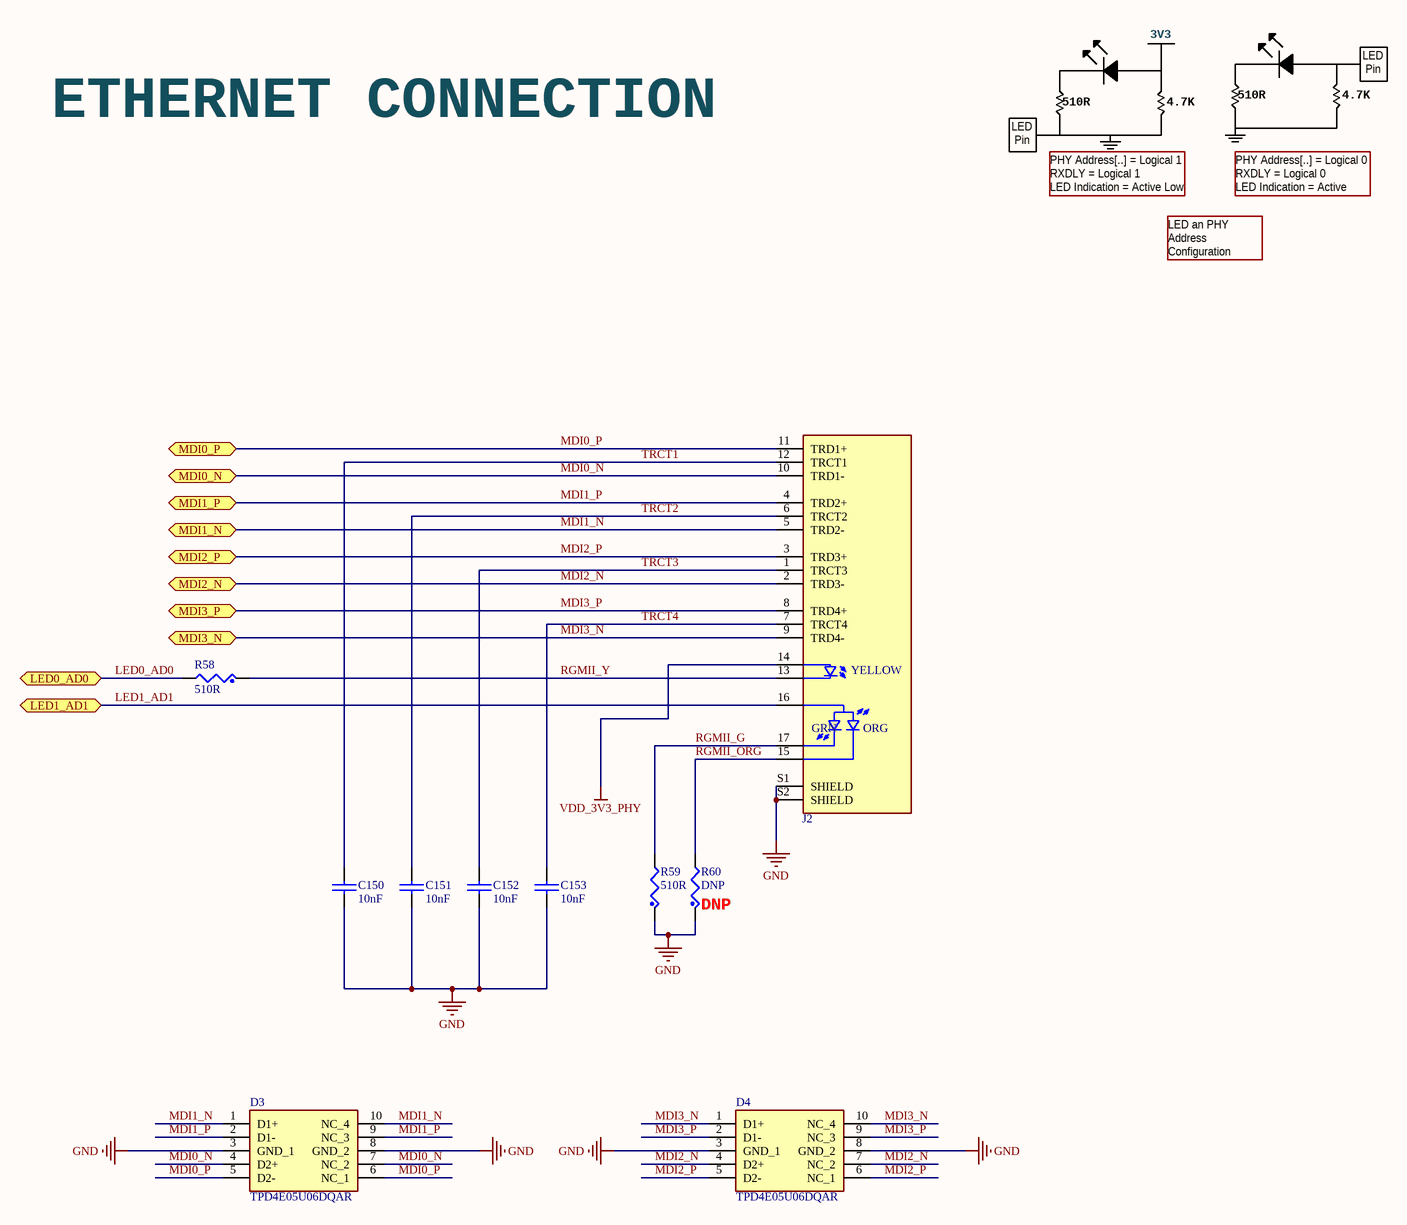
[diagram p16: ETHERNET.SchDoc]

### Parts
C150  10nF  [0402_CC - C]
C151  10nF  [0402_CC - C]
C152  10nF  [0402_CC - C]
C153  10nF  [0402_CC - C]
D3  TPD4E05U06DQAR  [DQA(R-PUSON-N10)]
D4  TPD4E05U06DQAR  [DQA(R-PUSON-N10)]
J2  L829-1J1T-43  [BEL_L829-1J1T-43]  (value not drawn)
R58  510R  [0402_CR]
R59  510R  [0402_CR]
R60  DNP  [0402_CR]

### Ports
LED0_AD0 (bidir), LED1_AD1 (bidir), MDI0_N (bidir), MDI0_P (bidir), MDI1_N (bidir), MDI1_P (bidir), MDI2_N (bidir), MDI2_P (bidir), MDI3_N (bidir), MDI3_P (bidir)

### Nets
GND: C150.2 C151.2 C152.2 C153.2 D3.3(GND_1) D3.8(GND_2) D4.3(GND_1) D4.8(GND_2) J2.S1(SHIELD) J2.S2(SHIELD) R59.1 R60.1
VDD_3V3_PHY: J2.14(YA_1)
LED0_AD0: R58.2 ; port LED0_AD0
LED1_AD1: J2.16(CA) ; port LED1_AD1
MDI0_N: D3.4(D2+) D3.7(NC_2) J2.10(TRD1-) ; port MDI0_N
MDI0_P: D3.5(D2-) D3.6(NC_1) J2.11(TRD1+) ; port MDI0_P
MDI1_N: D3.1(D1+) D3.10(NC_4) J2.5(TRD2-) ; port MDI1_N
MDI1_P: D3.2(D1-) D3.9(NC_3) J2.4(TRD2+) ; port MDI1_P
MDI2_N: D4.4(D2+) D4.7(NC_2) J2.2(TRD3-) ; port MDI2_N
MDI2_P: D4.5(D2-) D4.6(NC_1) J2.3(TRD3+) ; port MDI2_P
MDI3_N: D4.1(D1+) D4.10(NC_4) J2.9(TRD4-) ; port MDI3_N
MDI3_P: D4.2(D1-) D4.9(NC_3) J2.8(TRD4+) ; port MDI3_P
RGMII_G: J2.17(GK_1) R59.2
RGMII_ORG: J2.15(OK_1) R60.2
RGMII_Y: J2.13(YK_1) R58.1
TRCT1: C150.1 J2.12(TRCT1)
TRCT2: C151.1 J2.6(TRCT2)
TRCT3: C152.1 J2.1(TRCT3)
TRCT4: C153.1 J2.7(TRCT4)

### Notes on the sheet
- 3V3
- LED
  Pin
- ETHERNET CONNECTION
- 510R
- 4.7K
- PHY Address[..] = Logical 1
  RXDLY = Logical 1
  LED Indication = Active Low
- PHY Address[..] = Logical 0
  RXDLY = Logical 0
  LED Indication = Active High
- LED an PHY Address Configuration
- (near R60) DNP
- (in symbol L829-1J1T-43) YELLOW; GRN; ORG

### Library data of the parts
C150-C153 = CAP_NP: CLASS: DISCRETE
D3 D4 = TPD4E05U06DQAR: ESD Suppressors / TVS Diodes 4Chnl U-Lo Capacitnc IEC ESD Prot Diodes; Mfr: Texas Instruments; Datasheet Link: http://www.ti.com/lit/gpn/tpd4e05u06; Mfr_Part_No: TPD4E05U06DQAR; Mouser No: 595-TPD4E05U06DQAR; Mouser Price/Stock: https://www.mouser.co.uk/ProductDetail/Texas-Instruments/TPD4E05U06DQAR?qs=%2FCrDlo5IrVPi4woOvWz0qA%3D%3D; Arrow Part Number: TPD4E05U06DQAR; Arrow Price/Stock: https://www.arrow.com/en/products/tpd4e05u06dqar/texas-instruments?region=nac
J2 = L829-1J1T-43: MagJack 1000BASE-T | 1X1 | 3w-OG/Y | Tab Up | Low Profile | RoHS; Mfr: Bel Magnetic Solutions; Mfr_Part_No: L829-1J1T-43; Supplier 1: Mouser; Supplier Part Number 1: 530-L829-1J1T-43
R58-R60 = RES: CLASS: DISCRETE

## Sheet GPIO_HEADER.SchDoc
size A3; SheetNumber: 21; SheetTotal: 21
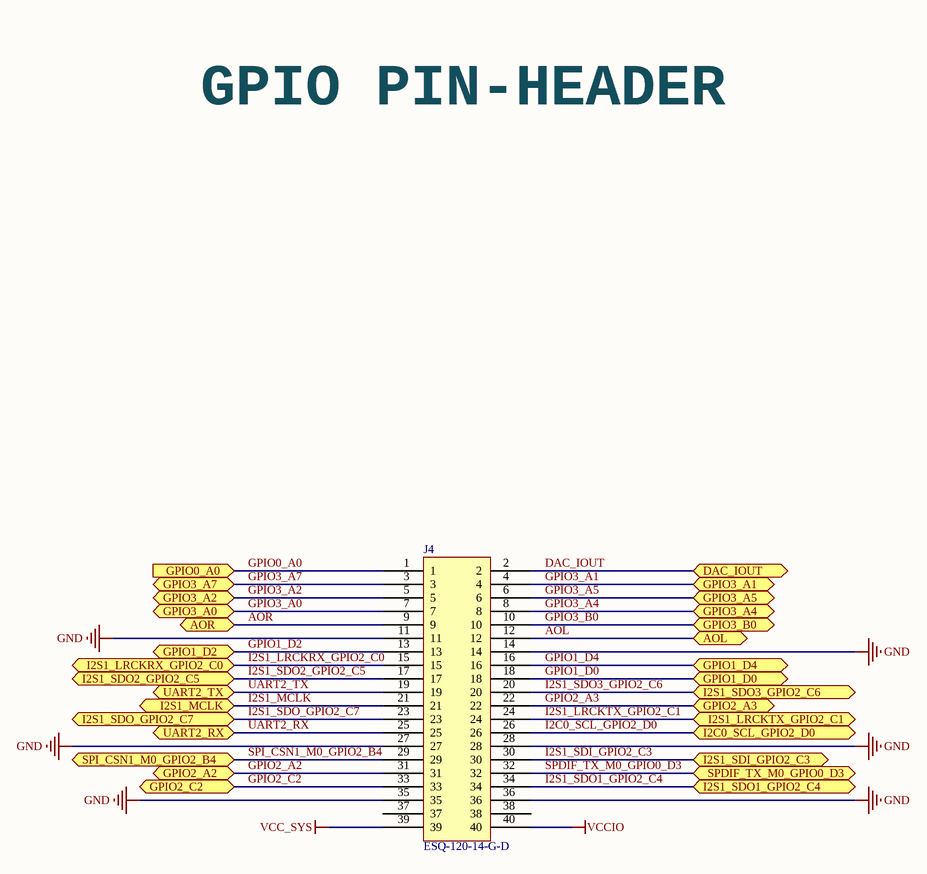
[diagram p17: GPIO_HEADER.SchDoc]

### Parts
J4  ESQ-120-14-G-D  [ESQ-120-14-G-D]

### Ports
AOL (bidir), AOR (bidir), DAC_IOUT (bidir), GPIO0_A0 (in), GPIO1_D0 (bidir), GPIO1_D2 (bidir), GPIO1_D4 (bidir), GPIO2_A2 (bidir), GPIO2_A3 (bidir), GPIO2_C2 (bidir), GPIO3_A0 (bidir), GPIO3_A1 (bidir), GPIO3_A2 (bidir), GPIO3_A4 (bidir), GPIO3_A5 (bidir), GPIO3_A7 (bidir), GPIO3_B0 (bidir), I2C0_SCL_GPIO2_D0 (bidir), I2S1_LRCKRX_GPIO2_C0 (bidir), I2S1_LRCKTX_GPIO2_C1 (bidir), I2S1_MCLK (bidir), I2S1_SDI_GPIO2_C3 (bidir), I2S1_SDO1_GPIO2_C4 (bidir), I2S1_SDO2_GPIO2_C5 (bidir), I2S1_SDO3_GPIO2_C6 (bidir), I2S1_SDO_GPIO2_C7 (bidir), SPDIF_TX_M0_GPIO0_D3 (bidir), SPI_CSN1_M0_GPIO2_B4 (bidir), UART2_RX (bidir), UART2_TX (bidir)

### Nets
GND: J4.11 J4.14 J4.27 J4.28 J4.35 J4.36
VCC_SYS: J4.39
VCCIO: J4.40
AOL: J4.12 ; port AOL
AOR: J4.9 ; port AOR
DAC_IOUT: J4.2 ; port DAC_IOUT
GPIO0_A0: J4.1 ; port GPIO0_A0
GPIO1_D0: J4.18 ; port GPIO1_D0
GPIO1_D2: J4.13 ; port GPIO1_D2
GPIO1_D4: J4.16 ; port GPIO1_D4
GPIO2_A2: J4.31 ; port GPIO2_A2
GPIO2_A3: J4.22 ; port GPIO2_A3
GPIO2_C2: J4.33 ; port GPIO2_C2
GPIO3_A0: J4.7 ; port GPIO3_A0
GPIO3_A1: J4.4 ; port GPIO3_A1
GPIO3_A2: J4.5 ; port GPIO3_A2
GPIO3_A4: J4.8 ; port GPIO3_A4
GPIO3_A5: J4.6 ; port GPIO3_A5
GPIO3_A7: J4.3 ; port GPIO3_A7
GPIO3_B0: J4.10 ; port GPIO3_B0
I2C0_SCL_GPIO2_D0: J4.26 ; port I2C0_SCL_GPIO2_D0
I2S1_LRCKRX_GPIO2_C0: J4.15 ; port I2S1_LRCKRX_GPIO2_C0
I2S1_LRCKTX_GPIO2_C1: J4.24 ; port I2S1_LRCKTX_GPIO2_C1
I2S1_MCLK: J4.21 ; port I2S1_MCLK
I2S1_SDI_GPIO2_C3: J4.30 ; port I2S1_SDI_GPIO2_C3
I2S1_SDO1_GPIO2_C4: J4.34 ; port I2S1_SDO1_GPIO2_C4
I2S1_SDO2_GPIO2_C5: J4.17 ; port I2S1_SDO2_GPIO2_C5
I2S1_SDO3_GPIO2_C6: J4.20 ; port I2S1_SDO3_GPIO2_C6
I2S1_SDO_GPIO2_C7: J4.23 ; port I2S1_SDO_GPIO2_C7
SPDIF_TX_M0_GPIO0_D3: J4.32 ; port SPDIF_TX_M0_GPIO0_D3
SPI_CSN1_M0_GPIO2_B4: J4.29 ; port SPI_CSN1_M0_GPIO2_B4
UART2_RX: J4.25 ; port UART2_RX
UART2_TX: J4.19 ; port UART2_TX

Not connected (* = marked no-connect by the designer): J4 37 38

### Notes on the sheet
- GPIO PIN-HEADER

### Library data of the parts
J4 = ESQ-120-14-G-D: CONN RCPT 40POS .100" DUAL GOLD; Mfr: Samtec Inc.; Connector Type: Receptacle; Number of Positions: 40; Number of Positions Loaded: All; Pitch: 0.100" (2.54mm); .Creator: MM; Supplier 1: Digi-Key; Mfr_Part_No: ESQ-120-14-G-D; RoHS: RoHS Compliant; Category: Connectors, Interconnects; Stock 1: 51; Pricing 1: 1=7.42, 10=6.864, 50=6.1586, 100=5.7505, 250=5.00852, 500=4.823, 1000=4.6375, 2500=4.452 (USD); Packaging: Tube; Contact Type: Female Socket; Number of Rows: 2; Row Spacing: 0.100" (2.54mm); Mounting Type: Through Hole; Termination: Solder; Fastening Type: -; Features: -; Contact Finish: Gold; Contact Finish Thickness: 20µin (0.51µm); Color: Black; ComponentLink1URL: http://suddendocs.samtec.com/prints/esq-1xx-xx-x-x-xxx-xx-x-xx-mkt.pdf; ComponentLink1Description: http://suddendocs.samtec.com/prints/esq-1xx-xx-x-x-xxx-xx-x-xx-mkt.pdf; Supplier Part Number 1: SAM8767-ND; .Checked PCB: MM; .Checked SCH: MM